# EAGLE design micromouse2019 (EAGLE 9.3.2)
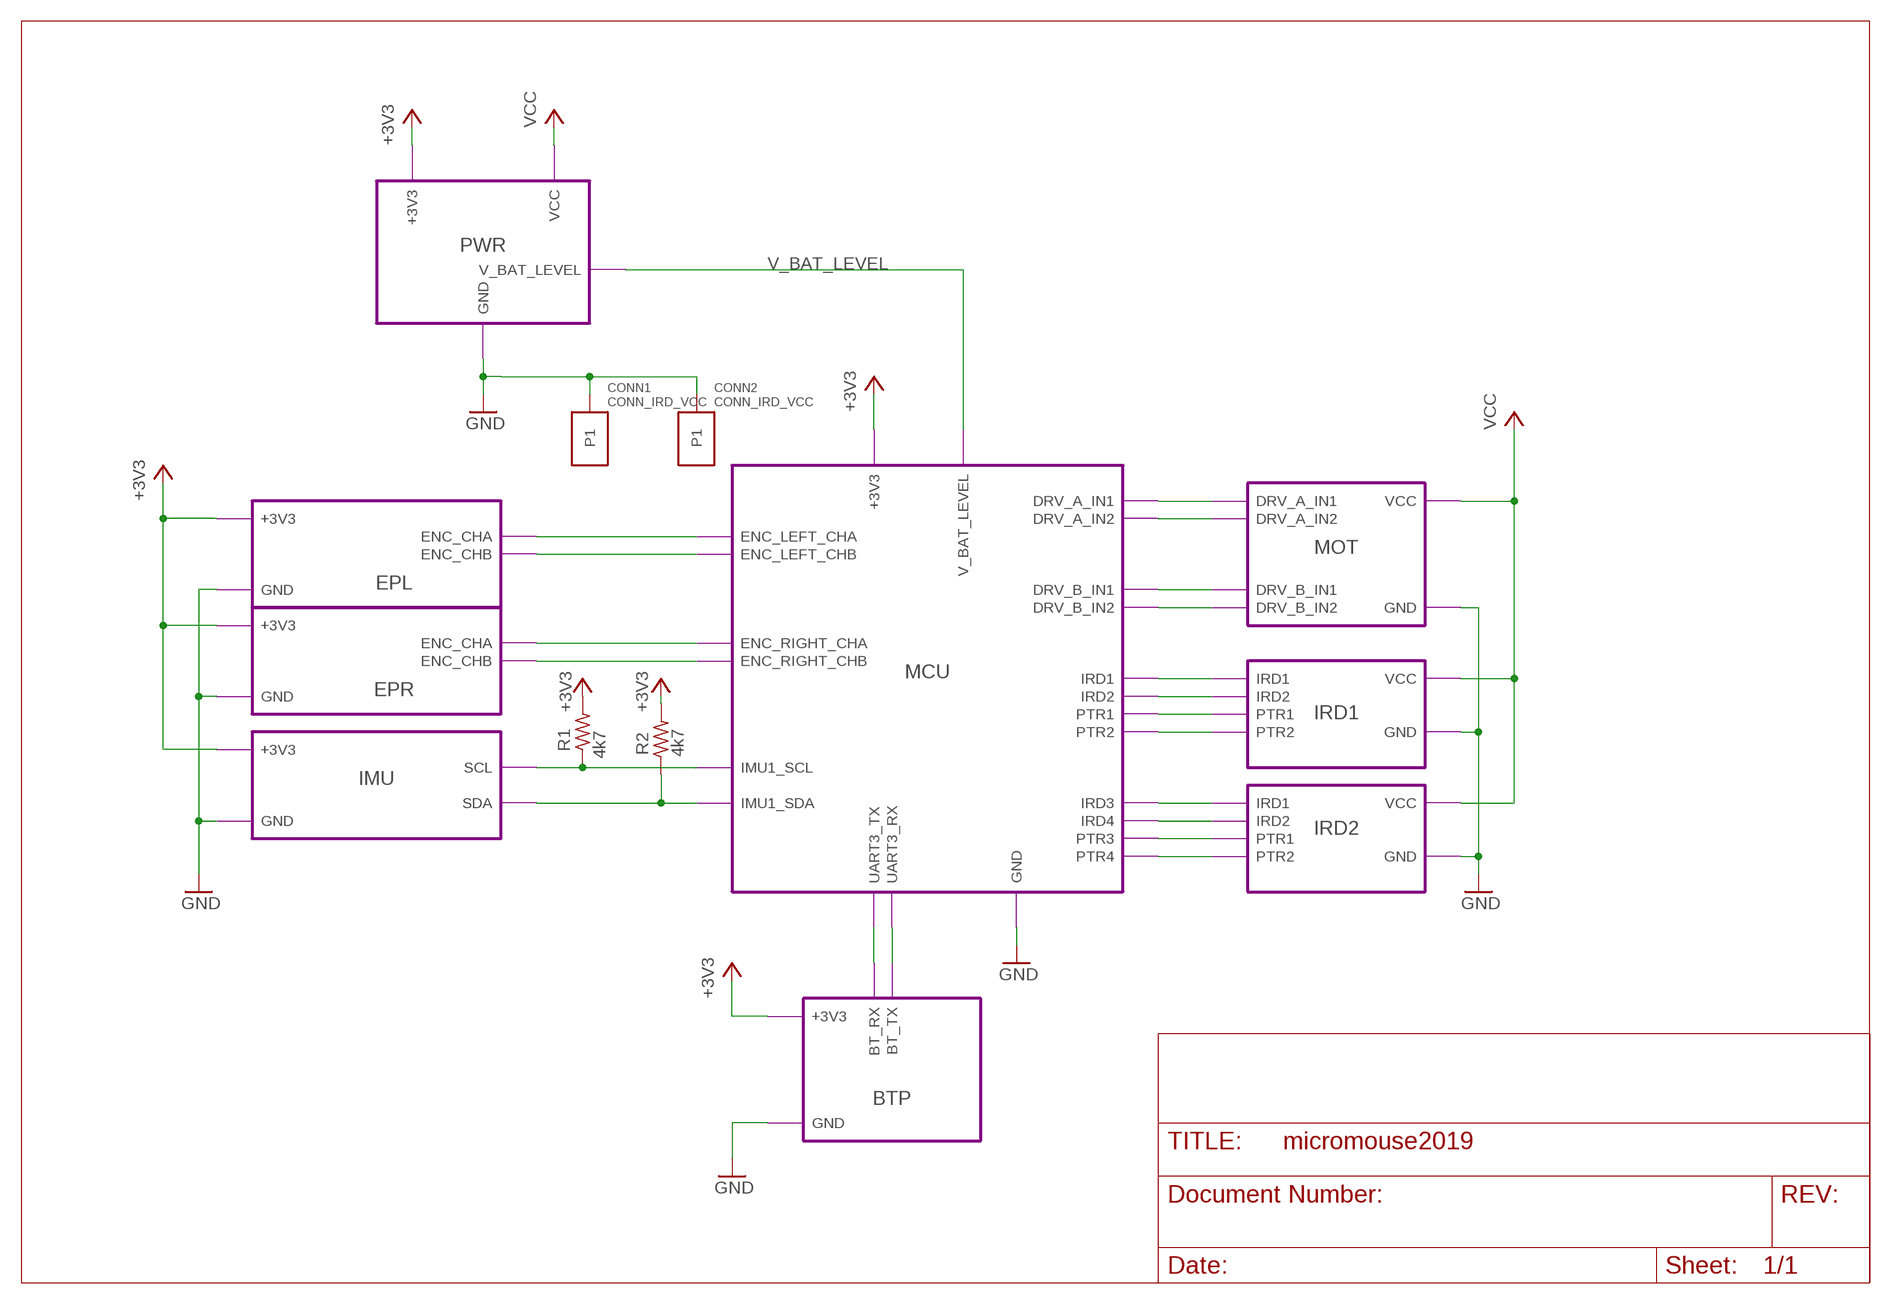
[diagram p0: schematic, sheet 1]

## Parts
CONN1  CONN_IRD_VCC  [CONN_IRD_VCC_HDRV1W64P0_1X1_254X254X838B]
CONN2  CONN_IRD_VCC  [CONN_IRD_VCC_HDRV1W64P0_1X1_254X254X838B]
R1  4k7  R-US_R0402  [R0402]
R2  4k7  R-US_R0402  [R0402]

## Module instances
PWR = POWER_REGULATOR
IMU = INERTIAL_MEASUREMENT_UNIT
MOT = MOTOR_DRIVER
EPR = ENCODER_PORT
BTP = WIRELESS_MODUL_PORT
EPL = ENCODER_PORT
MCU = MICROCONTROLLER
IRD1 = IR_LEDS_AND_PTS
IRD2 = IR_LEDS_AND_PTS

## Nets
+3V3: R1.2 R2.2 ; port PWR.+3V3 MCU.+3V3 IMU.+3V3 EPL.+3V3 EPR.+3V3 BTP.+3V3
DRV_A_IN1: port MOT.DRV_A_IN1 MCU.DRV_A_IN1
DRV_A_IN2: port MOT.DRV_A_IN2 MCU.DRV_A_IN2
DRV_B_IN1: port MOT.DRV_B_IN1 MCU.DRV_B_IN1
DRV_B_IN2: port MOT.DRV_B_IN2 MCU.DRV_B_IN2
ENC_LEFT_CHA: port EPL.ENC_CHA MCU.ENC_LEFT_CHA
ENC_LEFT_CHB: port EPL.ENC_CHB MCU.ENC_LEFT_CHB
ENC_RIGHT_CHA: port EPR.ENC_CHA MCU.ENC_RIGHT_CHA
ENC_RIGHT_CHB: port EPR.ENC_CHB MCU.ENC_RIGHT_CHB
GND: CONN1.1 CONN2.1 ; port PWR.GND IMU.GND EPL.GND EPR.GND MCU.GND MOT.GND IRD1.GND IRD2.GND BTP.GND
N$1: port MCU.IRD1 IRD1.IRD1
N$2: port MCU.IRD2 IRD1.IRD2
N$3: port MCU.PTR1 IRD1.PTR1
N$4: port MCU.PTR2 IRD1.PTR2
N$5: port MCU.IRD3 IRD2.IRD1
N$6: port MCU.IRD4 IRD2.IRD2
N$7: port MCU.PTR3 IRD2.PTR1
N$8: port MCU.PTR4 IRD2.PTR2
SCL: R1.1 ; port IMU.SCL MCU.IMU1_SCL
SDA: R2.1 ; port IMU.SDA MCU.IMU1_SDA
UART3_RX: port MCU.UART3_RX BTP.BT_TX
UART3_TX: port BTP.BT_RX MCU.UART3_TX
V_BAT_LEVEL: port PWR.V_BAT_LEVEL MCU.V_BAT_LEVEL
VCC: port PWR.VCC MOT.VCC IRD1.VCC IRD2.VCC

## Library data of the parts
CONN1 CONN2 = 0-micromouse2019:CONN_IRD_VCC: Pin for connection to +3v3 of IR LEDs and phototransistors
R1 R2 = 0-micromouse2019:R-US_: RESISTOR, American symbol; SPICEPREFIX: R

## Module POWER_REGULATOR
Ports: +3V3(pwr) VCC(pwr) GND(pwr) V_BAT_LEVEL(out)
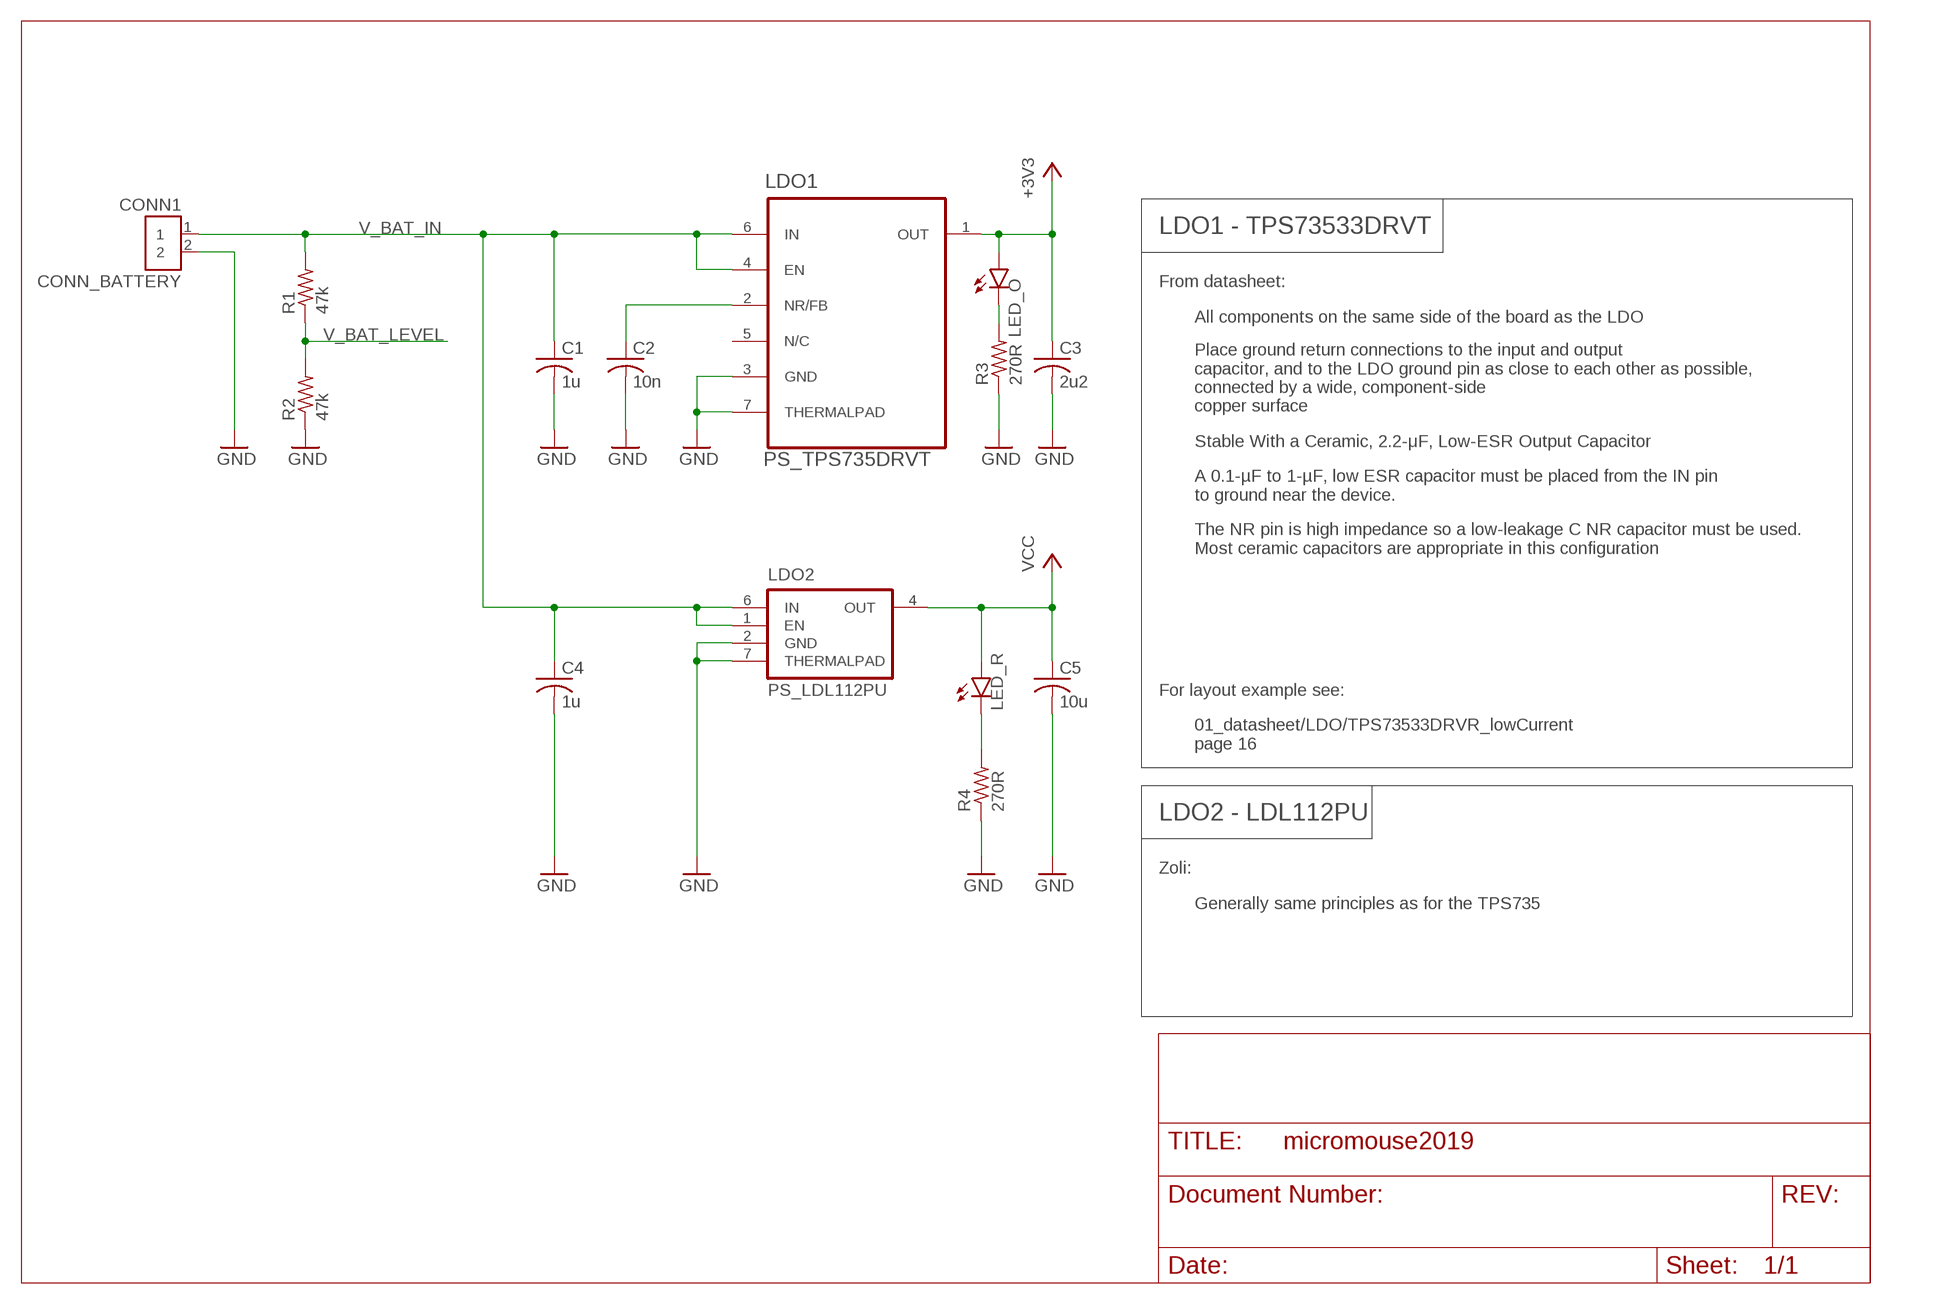
[diagram p1: schematic, module POWER_REGULATOR, sheet 1]

### Parts
C1  1u  C-USC0402  [C0402]
C2  10n  C-USC0402  [C0402]
C3  2u2  C-USC0402  [C0402]
C4  1u  C-USC0402  [C0402]
C5  10u  C-USC0402  [C0402]
CONN1  CONN_BATTERY  [JST_B2B-PH-K-S(LF)(SN)]
LDO1  PS_TPS735DRVT  [SON65P200X200X80-7T100X160]
LDO2  PS_LDL112PU  [SON50P200X200X80-7T92X145]
LED1  LED_O  [0603-ORANGE]
LED2  LED_R  [0603-RED]
R1  47k  R-US_R0402  [R0402]
R2  47k  R-US_R0402  [R0402]
R3  270R  R-US_R0402  [R0402]
R4  270R  R-US_R0402  [R0402]

### Nets
+3V3: C3.1 LDO1.1(OUT) LED1.A
GND: C1.2 C2.2 C3.2 C4.2 C5.2 CONN1.2 LDO1.3(GND) LDO1.7(THERMALPAD) LDO2.2(GND) LDO2.7(THERMALPAD) R2.1 R3.1 R4.1
N$1: C2.1 LDO1.2(NR/FB)
N$2: LED1.C R3.2
N$4: LED2.C R4.2
V_BAT_IN: C1.1 C4.1 CONN1.1 LDO1.4(EN) LDO1.6(IN) LDO2.1(EN) LDO2.6(IN) R1.2
V_BAT_LEVEL: R1.1 R2.2
VCC: C5.1 LDO2.4(OUT) LED2.A
Unconnected: LDO1.5(N/C)

### Notes on the sheet
- LDO1 - TPS73533DRVT
- From datasheet:
- All components on the same side of the board as the LDO
- Place ground return connections to the input and output
  capacitor, and to the LDO ground pin as close to each other as possible,
  connected by a wide, component-side
  copper surface
- Stable With a Ceramic, 2.2-μF, Low-ESR Output Capacitor
- A 0.1-µF to 1-µF, low ESR capacitor must be placed from the IN pin
  to ground near the device.
- The NR pin is high impedance so a low-leakage C NR capacitor must be used.
  Most ceramic capacitors are appropriate in this configuration
- For layout example see:
- 01_datasheet/LDO/TPS73533DRVR_lowCurrent
  page 16
- LDO2 - LDL112PU
- Zoli:
- Generally same principles as for the TPS735

### Library data of the parts
C1-C5 = 0-micromouse2019:C-US: CAPACITOR, American symbol; SPICEPREFIX: C
CONN1 = 0-micromouse2019:CONN_BATTERY: PH Series 2 Position 2 mm Pitch Through Hole Top Entry Shrouded Header; AVAILABILITY: Unavailable; DESCRIPTION: PH Series 2 Position 2 mm Pitch Through Hole Top Entry Shrouded Header; MF: JST Sales; MP: B2B-PH-K-S(LF)(SN); PACKAGE: None; PRICE: None
LDO1 = 0-micromouse2019:PS_TPS735: 500mA, Low Quiescent Current, Ultra-Low Noise, High PSRR Low Dropout Linear Regulator
LDO2 = 0-micromouse2019:PS_LDL112: Low-dropout linear regulator from ST. The LDL112 is a low-dropout linear regulator, which can provide a maximum current of 1.2 A, with a typical dropout voltage of 300 mV.
LED1 LED2 = 0-micromouse2019:LED: Indicator LEDs; SERIES_RESISTOR: 270R
R1-R4 = 0-micromouse2019:R-US_: RESISTOR, American symbol; SPICEPREFIX: R

## Module INERTIAL_MEASUREMENT_UNIT
Ports: SDA(io) SCL(io) +3V3(pwr) GND(pwr)
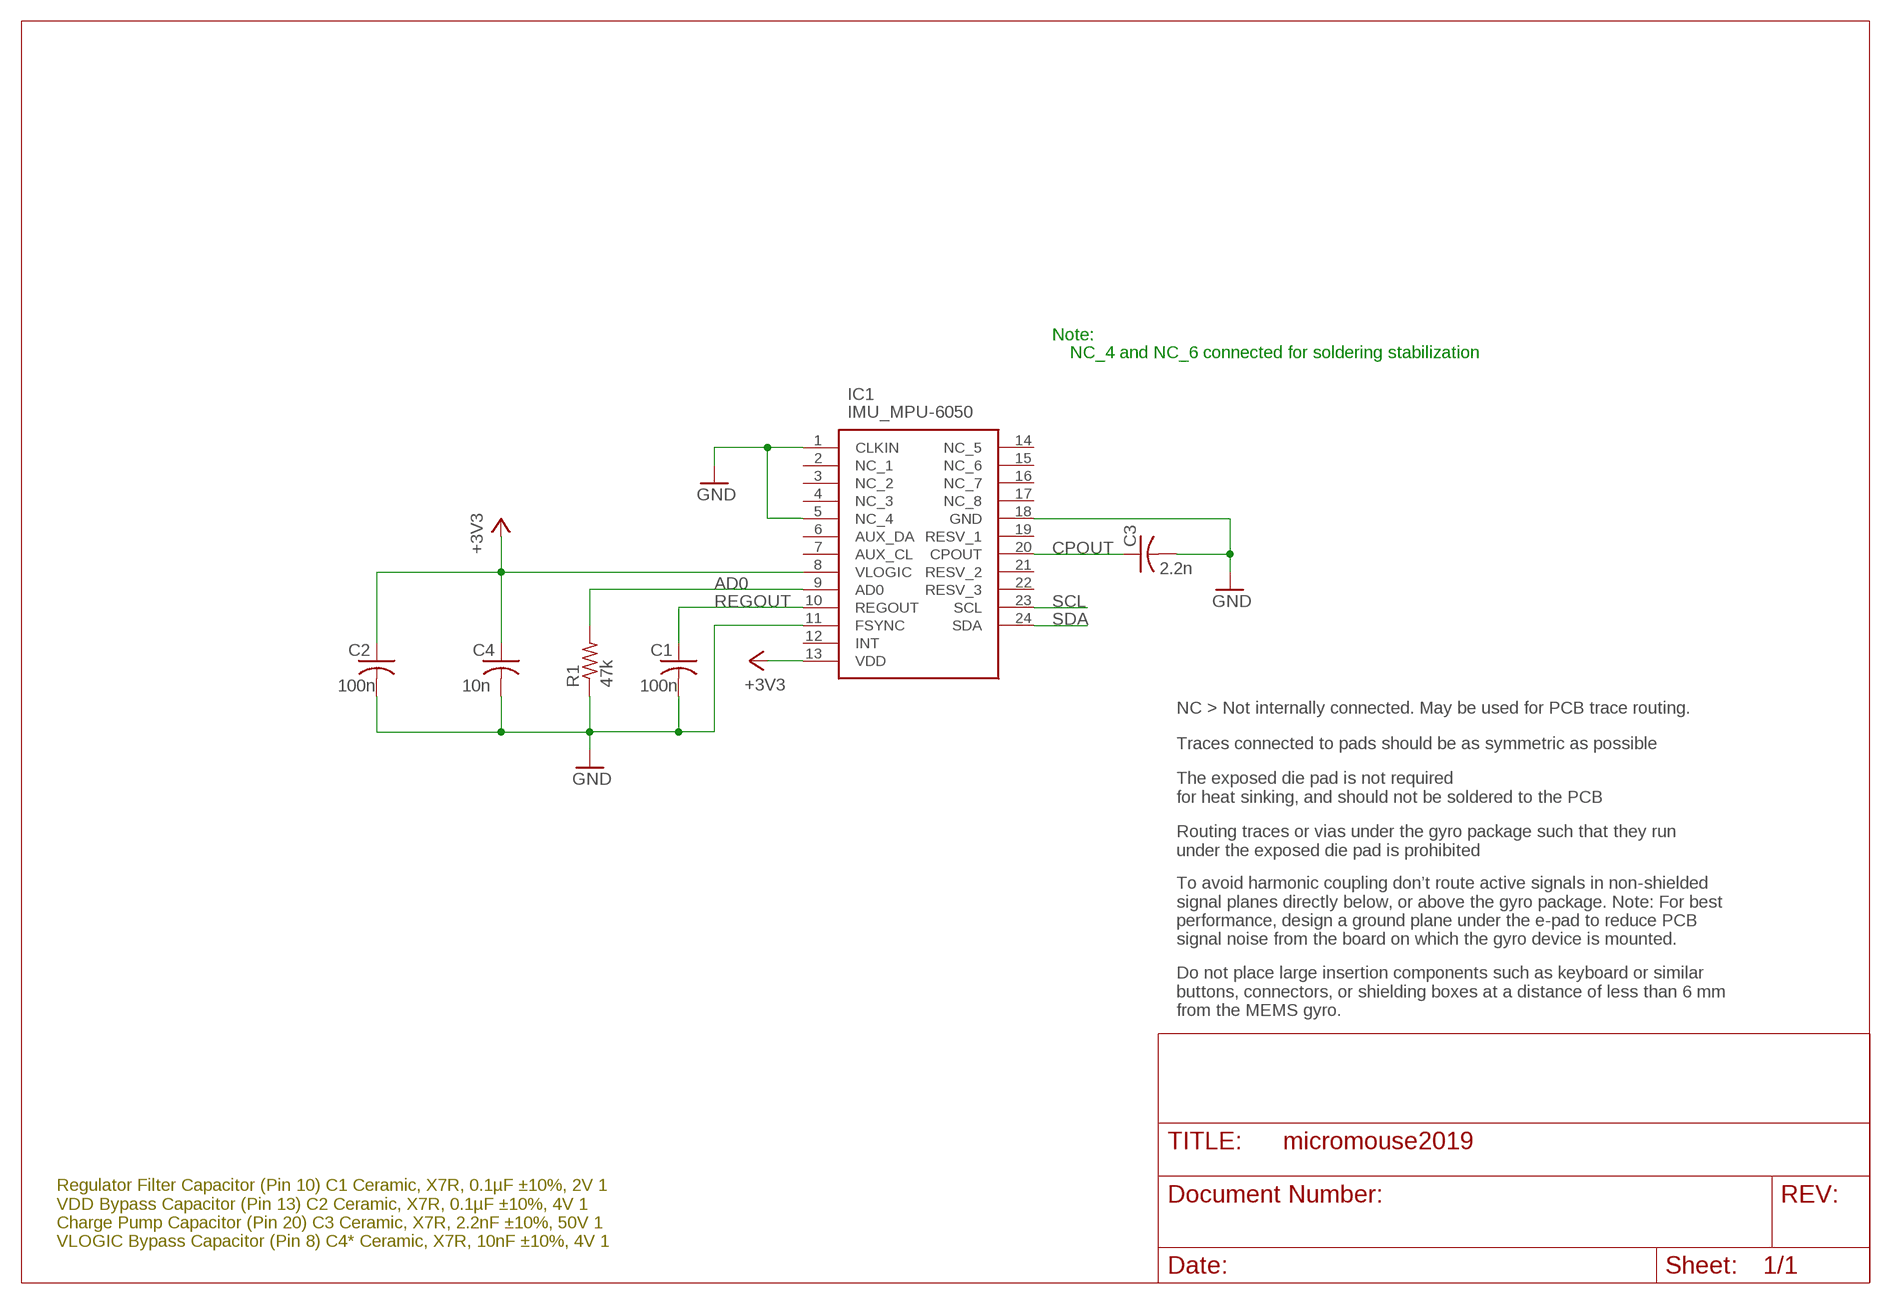
[diagram p2: schematic, module INERTIAL_MEASUREMENT_UNIT, sheet 1]

### Parts
C1  100n  C-USC0402  [C0402]
C2  100n  C-USC0402  [C0402]
C3  2.2n  C-USC0402  [C0402]
C4  10n  C-USC0402  [C0402]
IC1  IMU_MPU-6050  [MPU6050]
R1  47k  R-US_R0402  [R0402]

### Nets
+3V3: C2.1 C4.1 IC1.8(VLOGIC) IC1.13(VDD)
AD0: IC1.9(AD0) R1.2
CPOUT: C3.1 IC1.20(CPOUT)
GND: C1.2 C2.2 C3.2 C4.2 IC1.1(CLKIN) IC1.5(NC_4) IC1.11(FSYNC) IC1.18(GND) R1.1
REGOUT: C1.1 IC1.10(REGOUT)
SCL: IC1.23(SCL)
SDA: IC1.24(SDA)
Unconnected: IC1.2(NC_1) IC1.3(NC_2) IC1.4(NC_3) IC1.6(AUX_DA) IC1.7(AUX_CL) IC1.12(INT) IC1.14(NC_5) IC1.15(NC_6) IC1.16(NC_7) IC1.17(NC_8) IC1.19(RESV_1) IC1.21(RESV_2) IC1.22(RESV_3)

### Notes on the sheet
- Note:
- NC_4 and NC_6 connected for soldering stabilization
- NC > Not internally connected. May be used for PCB trace routing.
- Traces connected to pads should be as symmetric as possible
- The exposed die pad is not required
  for heat sinking, and should not be soldered to the PCB
- Routing traces or vias under the gyro package such that they run
  under the exposed die pad is prohibited
- To avoid harmonic coupling don’t route active signals in non-shielded
  signal planes directly below, or above the gyro package. Note: For best
  performance, design a ground plane under the e-pad to reduce PCB
  signal noise from the board on which the gyro device is mounted.
- Do not place large insertion components such as keyboard or similar
  buttons, connectors, or shielding boxes at a distance of less than 6 mm
  from the MEMS gyro.
- Regulator Filter Capacitor (Pin 10) C1 Ceramic, X7R, 0.1µF ±10%, 2V 1
  VDD Bypass Capacitor (Pin 13) C2 Ceramic, X7R, 0.1µF ±10%, 4V 1
  Charge Pump Capacitor (Pin 20) C3 Ceramic, X7R, 2.2nF ±10%, 50V 1
  VLOGIC Bypass Capacitor (Pin 8) C4* Ceramic, X7R, 10nF ±10%, 4V 1

### Library data of the parts
C1-C4 = 0-micromouse2019:C-US: CAPACITOR, American symbol; SPICEPREFIX: C
IC1 = 0-micromouse2019:IMU_MPU-6050: IMUs - Inertial Measurement Units 6-Axis MEMS MotionTracking Device with DMP Source: Datasheet <https://www.mouser.mx/datasheet/2/400/MPU-6000-Datasheet1-1112286.pdf>; DESCRIPTION: IMUs - Inertial Measurement Units 6-Axis MEMS MotionTracking Device with DMP; HEIGHT: 3mm; MANUFACTURER_NAME: TDK; MANUFACTURER_PART_NUMBER: MPU-6050; MOUSER_PART_NUMBER: 410-MPU-6050
R1 = 0-micromouse2019:R-US_: RESISTOR, American symbol; SPICEPREFIX: R

## Module MOTOR_DRIVER
Ports: VCC(pwr) GND(pwr) DRV_A_IN1(in) DRV_A_IN2(in) DRV_B_IN1(in) DRV_B_IN2(in)
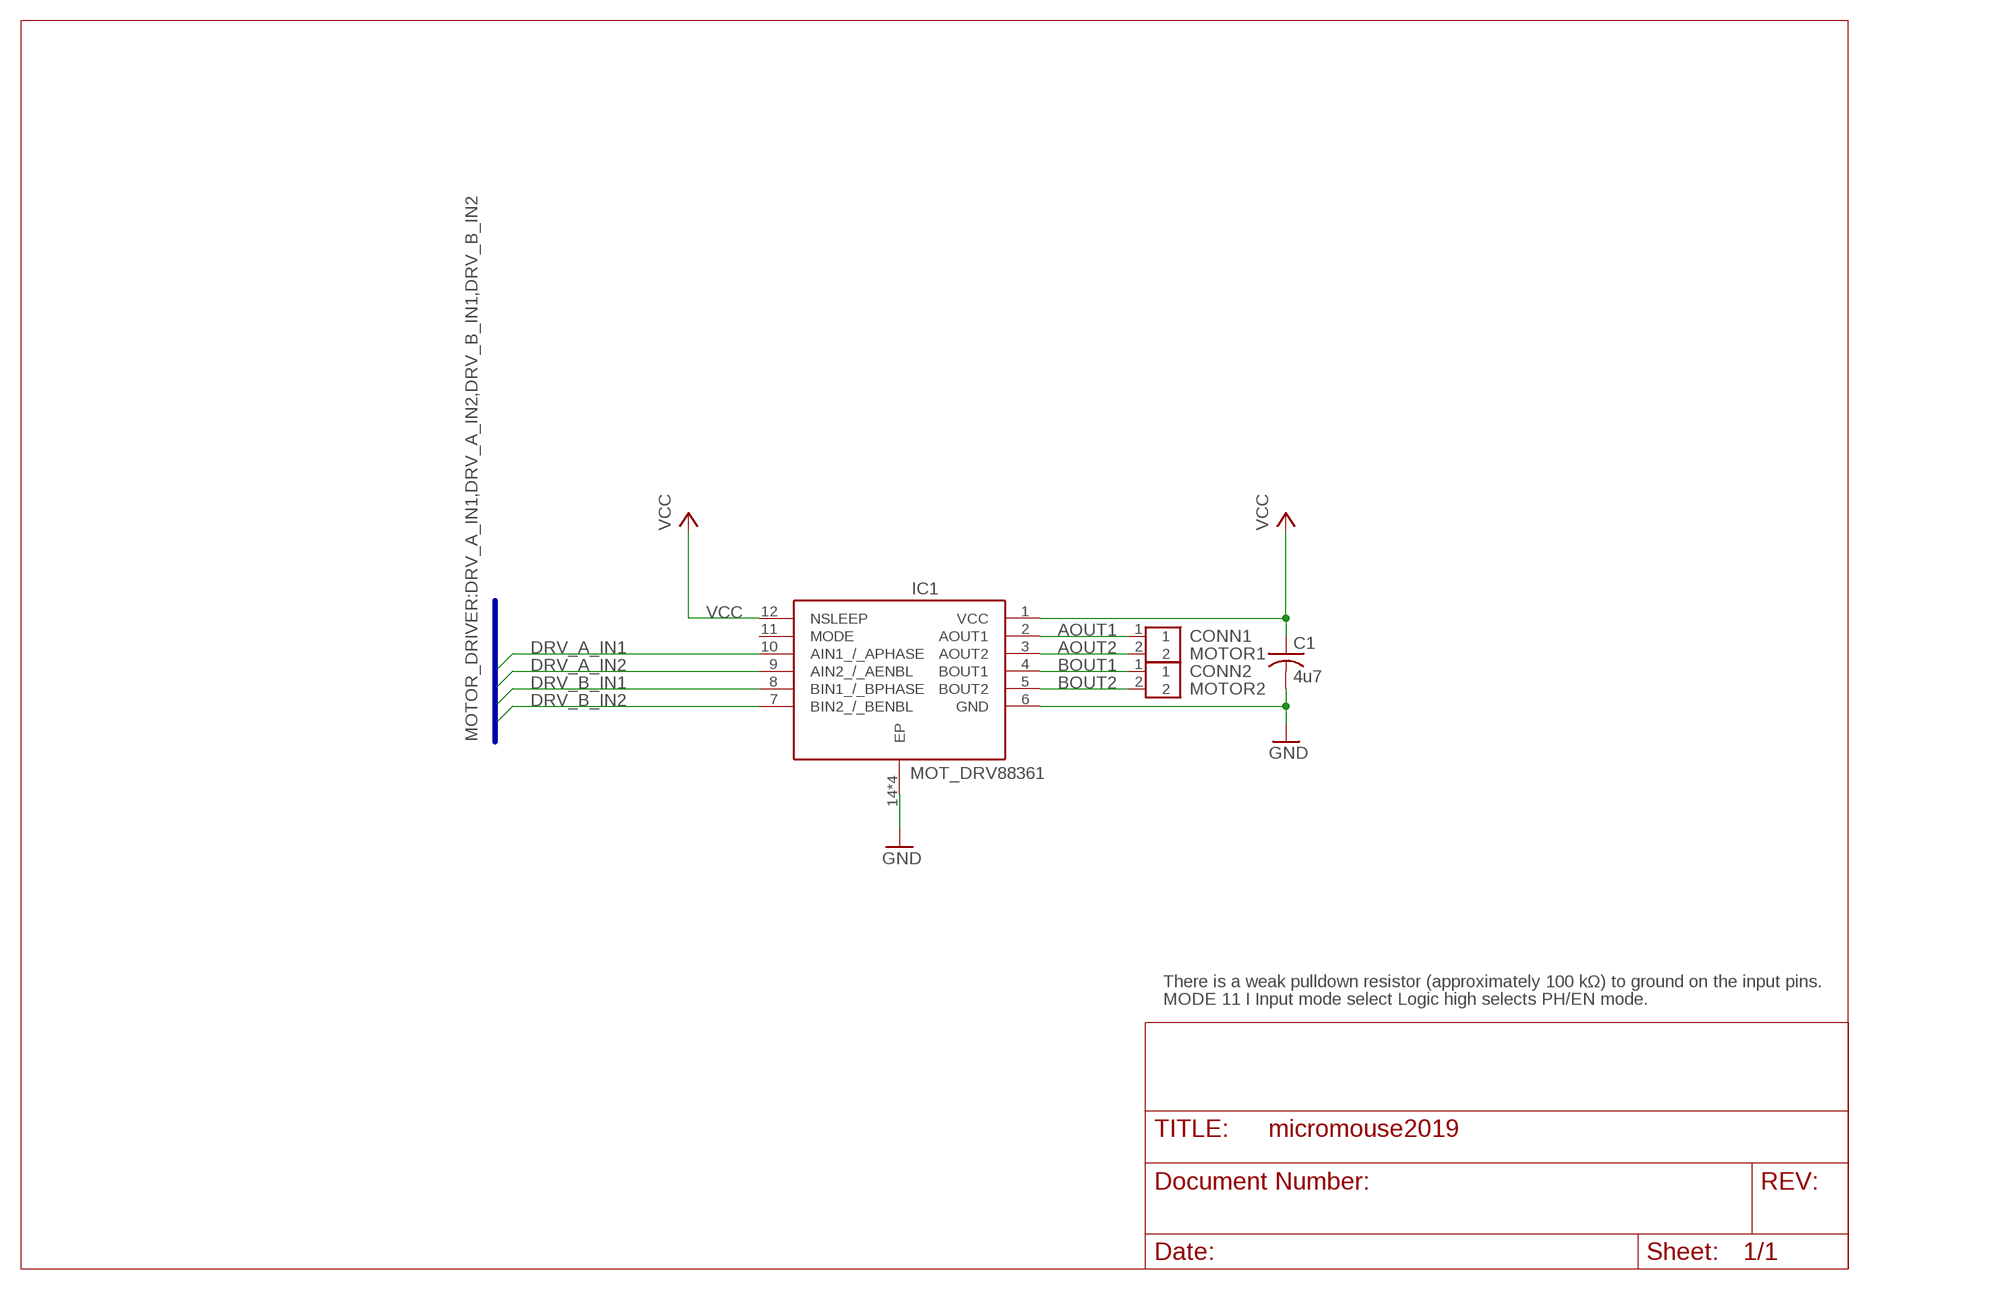
[diagram p3: schematic, module MOTOR_DRIVER, sheet 1]

### Parts
C1  4u7  C-USC0402  [C0402]
CONN1  MOTOR1  CONN_MOTOR  [BM02B-SRSS-TB(LFSN)]
CONN2  MOTOR2  CONN_MOTOR  [BM02B-SRSS-TB(LFSN)]
IC1  MOT_DRV88361  [DRV8836]

### Nets
AOUT1: CONN1.1 IC1.2(AOUT1)
AOUT2: CONN1.2 IC1.3(AOUT2)
BOUT1: CONN2.1 IC1.4(BOUT1)
BOUT2: CONN2.2 IC1.5(BOUT2)
DRV_A_IN1: IC1.10(AIN1_/_APHASE)
DRV_A_IN2: IC1.9(AIN2_/_AENBL)
DRV_B_IN1: IC1.8(BIN1_/_BPHASE)
DRV_B_IN2: IC1.7(BIN2_/_BENBL)
GND: C1.2 IC1.6(GND) IC1.14(EP) IC1.15(EP) IC1.16(EP) IC1.17(EP)
VCC: C1.1 IC1.1(VCC) IC1.12(NSLEEP)
Unconnected: IC1.11(MODE)

### Buses
MOTOR_DRIVER:DRV_A_IN1,DRV_A_IN2,DRV_B_IN1,DRV_B_IN2

### Notes on the sheet
- There is a weak pulldown resistor (approximately 100 kΩ) to ground on the input pins.
- MODE 11 I Input mode select Logic high selects PH/EN mode.

### Library data of the parts
C1 = 0-micromouse2019:C-US: CAPACITOR, American symbol; SPICEPREFIX: C
CONN1 CONN2 = 0-micromouse2019:CONN_MOTOR: 2 way top entry SMT header,1mm pitch JST SH Series, 1mm Pitch 2 Way 1 Row Straight PCB Header, Solder Termination, 1A Source: Datasheet <http://uk.rs-online.com/web/p/products/5151529P>; ALLIED_NUMBER: R1044255; DESCRIPTION: 2 way top entry SMT header,1mm pitch JST SH Series, 1mm Pitch 2 Way 1 Row Straight PCB Header, Solder Termination, 1A; HEIGHT: mm; MANUFACTURER_NAME: JST (JAPAN SOLDERLESS TERMINALS); MANUFACTURER_PART_NUMBER: BM02B-SRSS-TB(LFSN); RS_PART_NUMBER: 5151529P; RS_PRICE-STOCK: https://www.alliedelec.com/jst-manufacturing-bm02b-srss-tb-lfsn-/R1044255/
IC1 = 0-micromouse2019:MOT_DRV8836: 1.5A Low Voltage Stepper or Single/Dual Brushed DC Motor Driver (PWM or PH/EN Ctrl) Source: Datasheet <http://www.ti.com/lit/gpn/drv8836>; DESCRIPTION: 1.5A Low Voltage Stepper or Single/Dual Brushed DC Motor Driver (PWM or PH/EN Ctrl); HEIGHT: 0.8mm; MANUFACTURER_NAME: Texas Instruments; MANUFACTURER_PART_NUMBER: DRV8836DSSR; MOUSER_PART_NUMBER: 595-DRV8836DSSR

## Module ENCODER_PORT
Ports: ENC_CHA(out) ENC_CHB(out) +3V3(pwr) GND(pwr)
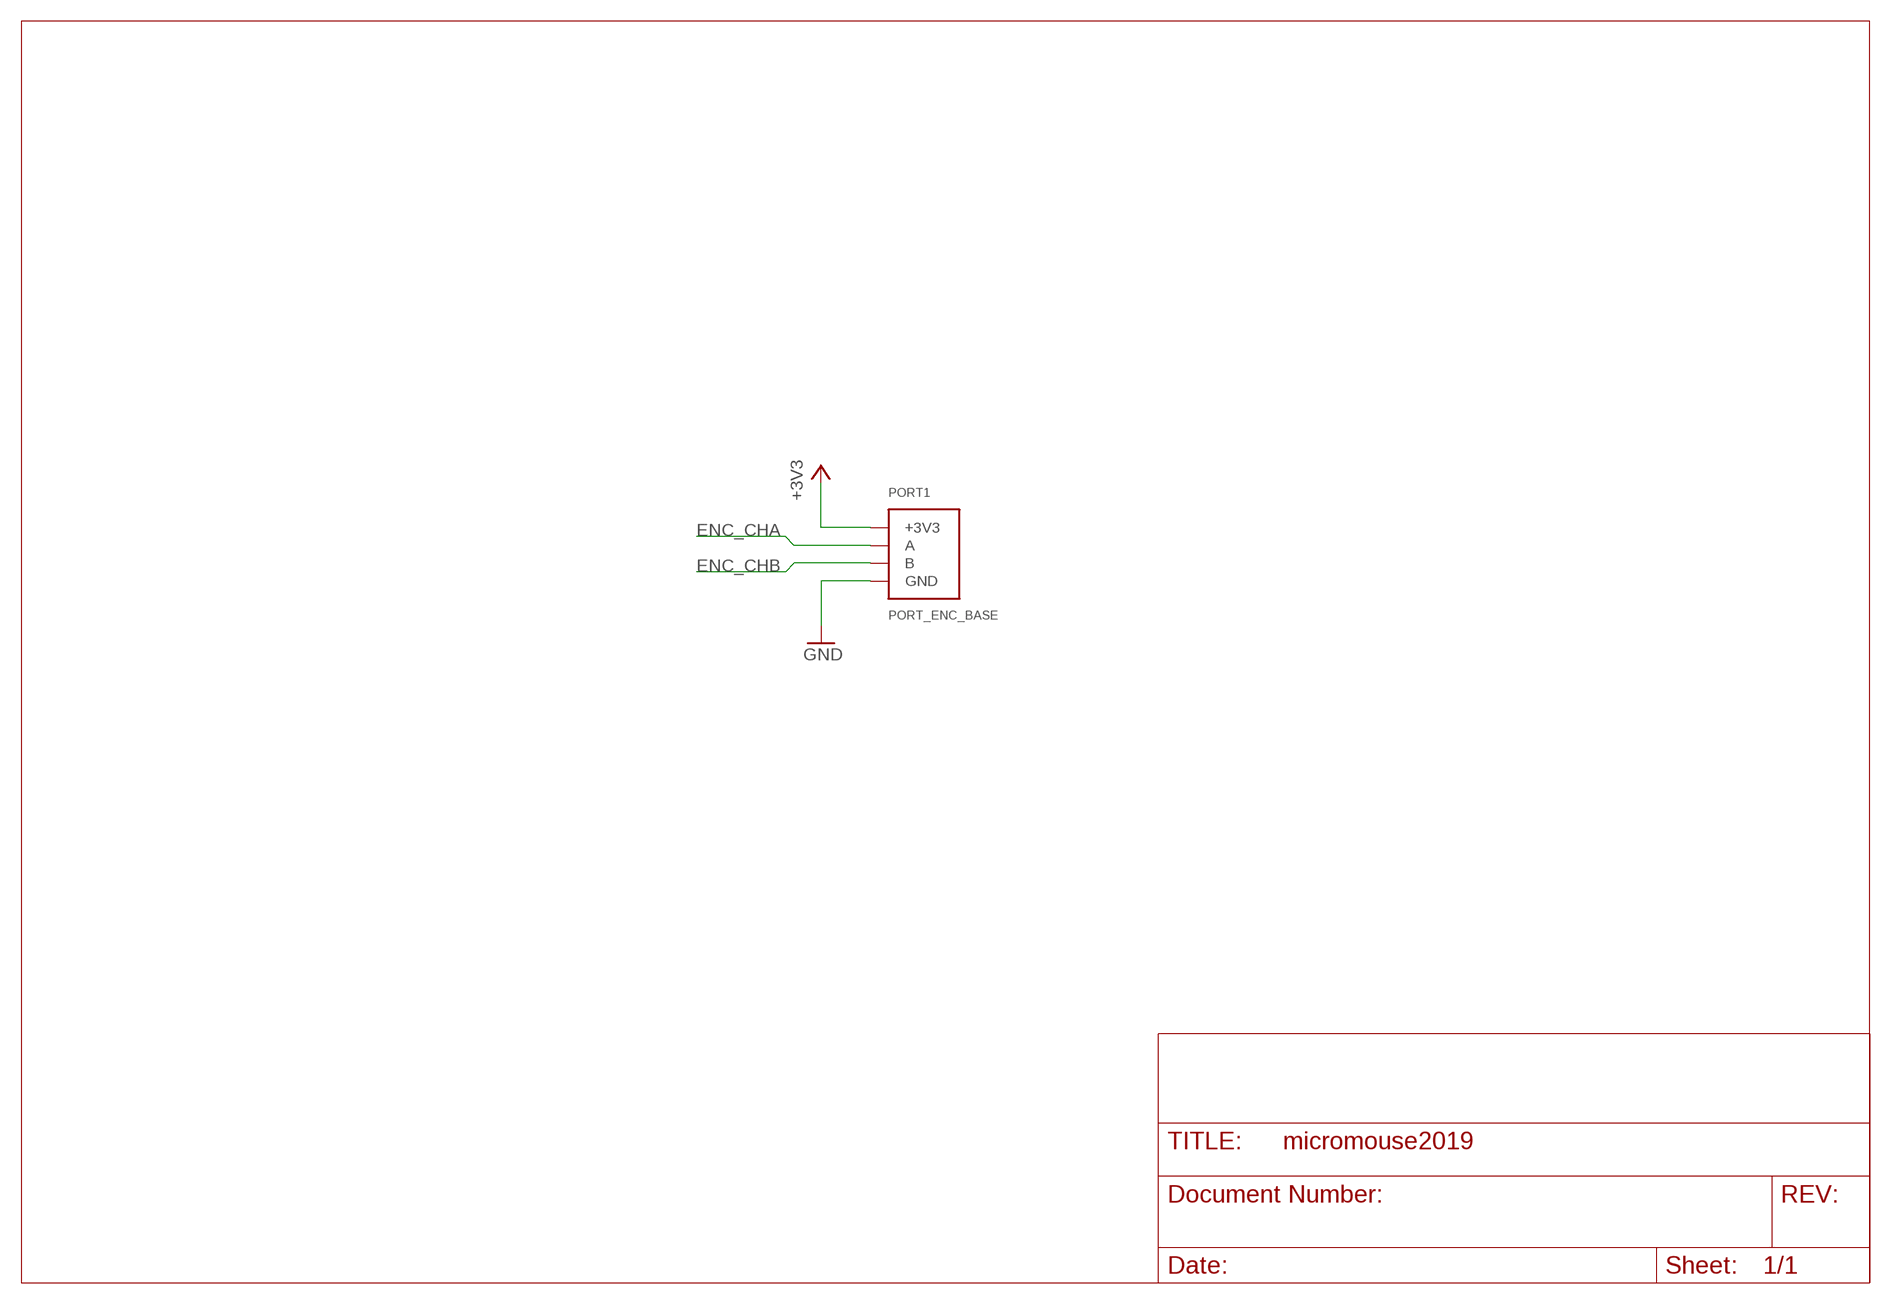
[diagram p4: schematic, module ENCODER_PORT, sheet 1]

### Parts
PORT1  PORT_ENC_BASE  [ENC_PORT_BASE]

### Nets
+3V3: PORT1.P3(+3V3)
ENC_CHA: PORT1.P1(A)
ENC_CHB: PORT1.P2(B)
GND: PORT1.P4(GND)

### Library data of the parts
PORT1 = 0-micromouse2019:PORT_ENC: Connection pins between ENC_PCB and MOUSE_PCB

## Module WIRELESS_MODUL_PORT
Ports: BT_TX(out) BT_RX(in) +3V3(pwr) GND(pwr)
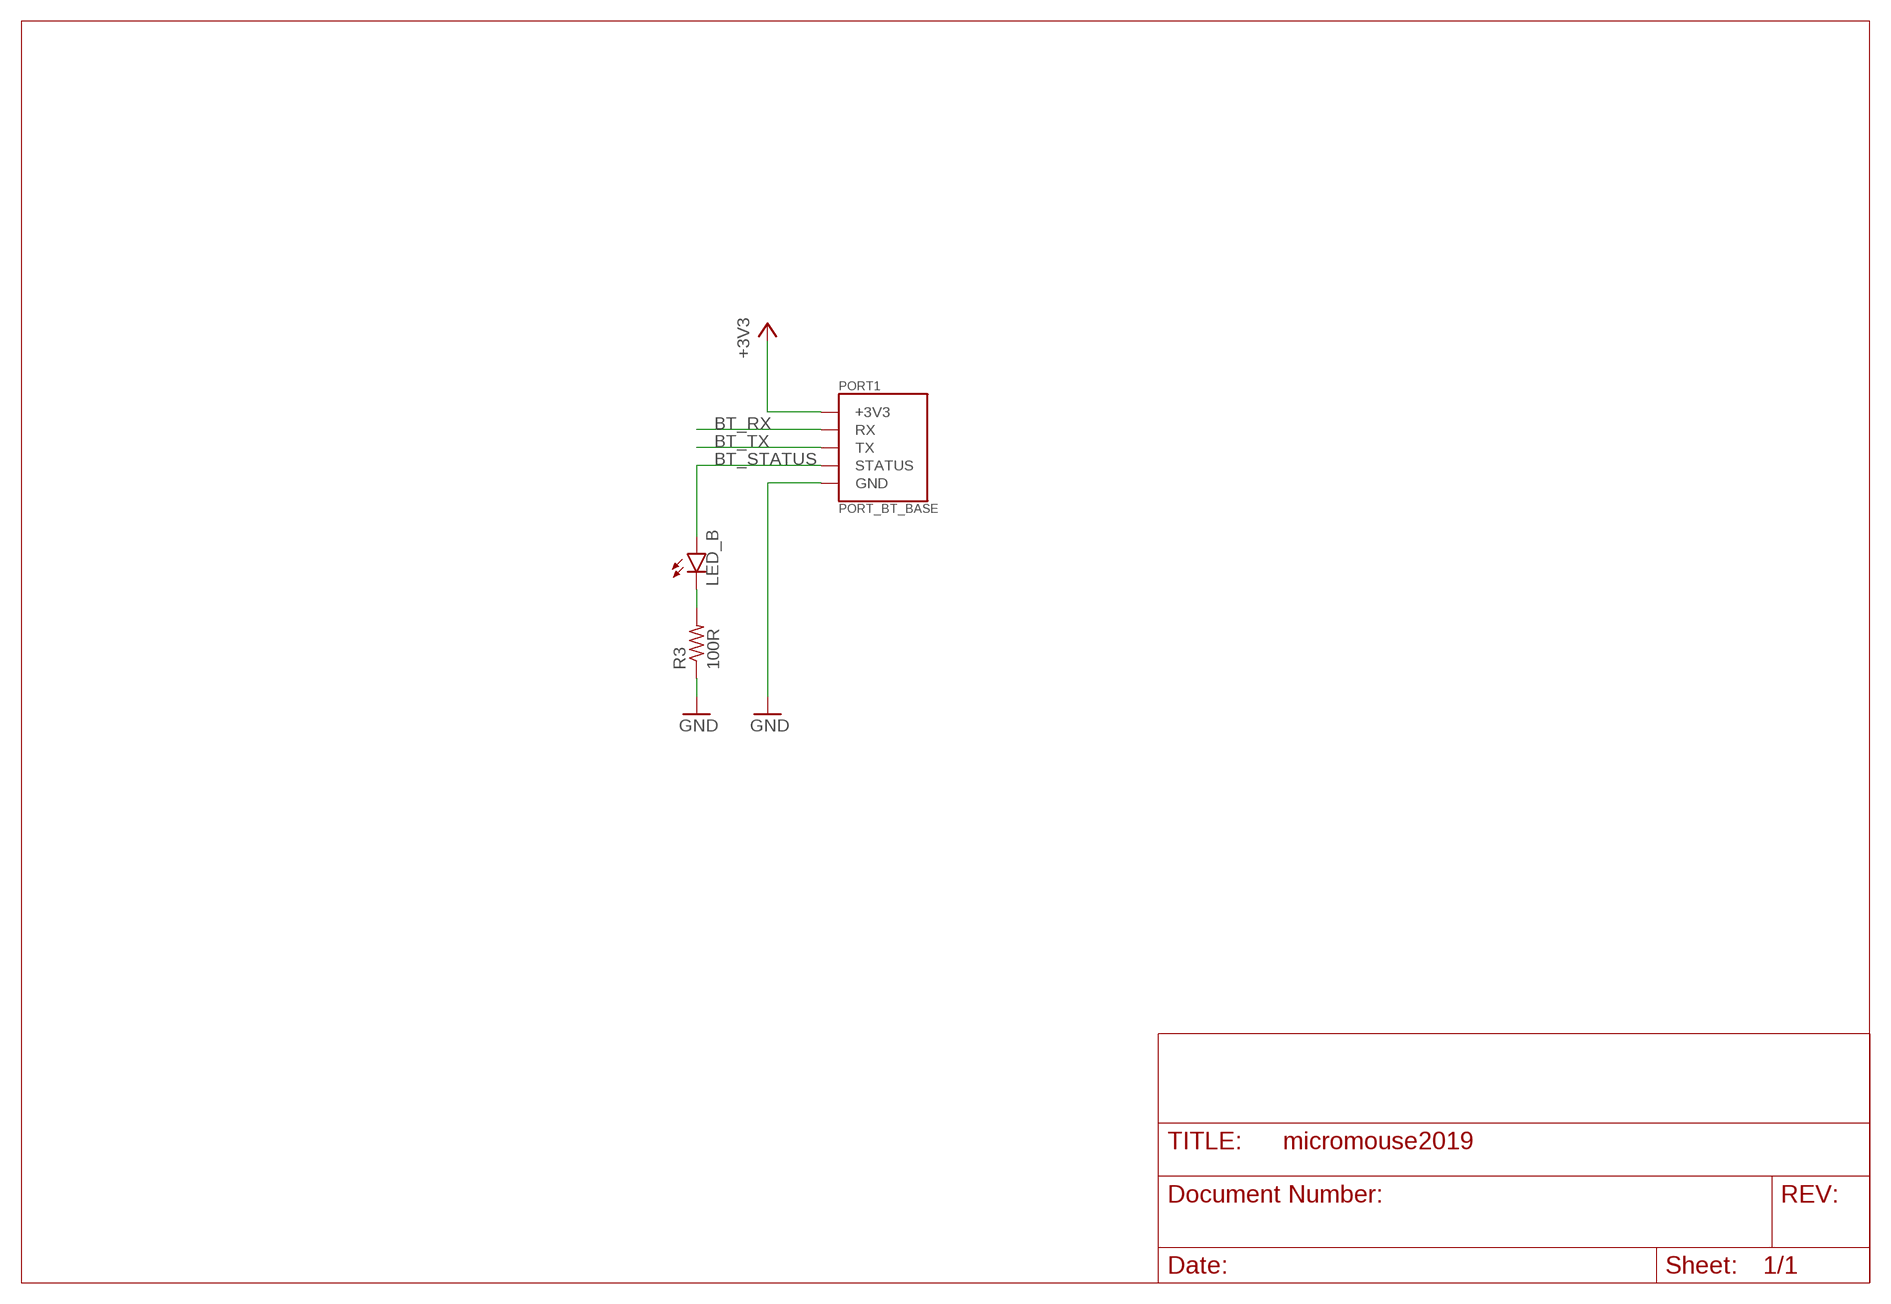
[diagram p5: schematic, module WIRELESS_MODUL_PORT, sheet 1]

### Parts
LED3  LED_B  [0603-BLUE]
PORT1  PORT_BT_BASE  [BT_PORT_BASE]
R3  100R  R-US_R0402  [R0402]

### Nets
+3V3: PORT1.P$15(+3V3)
BT_RX: PORT1.P$9(RX)
BT_STATUS: LED3.A PORT1.P$11(STATUS)
BT_TX: PORT1.P$8(TX)
GND: PORT1.P$14(GND) R3.1
N$3: LED3.C R3.2

### Library data of the parts
LED3 = 0-micromouse2019:LED: Indicator LEDs; SERIES_RESISTOR: 100R
PORT1 = 0-micromouse2019:PORT_BT: Port between mouse pcb and bluetooth module
R3 = 0-micromouse2019:R-US_: RESISTOR, American symbol; SPICEPREFIX: R

## Module MICROCONTROLLER
Ports: +3V3(pwr) V_BAT_LEVEL(pwr) UART3_TX(out) UART3_RX(in) ENC_LEFT_CHA(in) ENC_LEFT_CHB(in) ENC_RIGHT_CHA(in) ENC_RIGHT_CHB(in) IMU1_SCL(io) IMU1_SDA(io) GND(pwr) IRD1(out) IRD2(out) IRD3(out) IRD4(out) PTR1(in) PTR2(in) PTR3(in) PTR4(in) DRV_A_IN1(out) DRV_A_IN2(out) DRV_B_IN1(out) DRV_B_IN2(out)
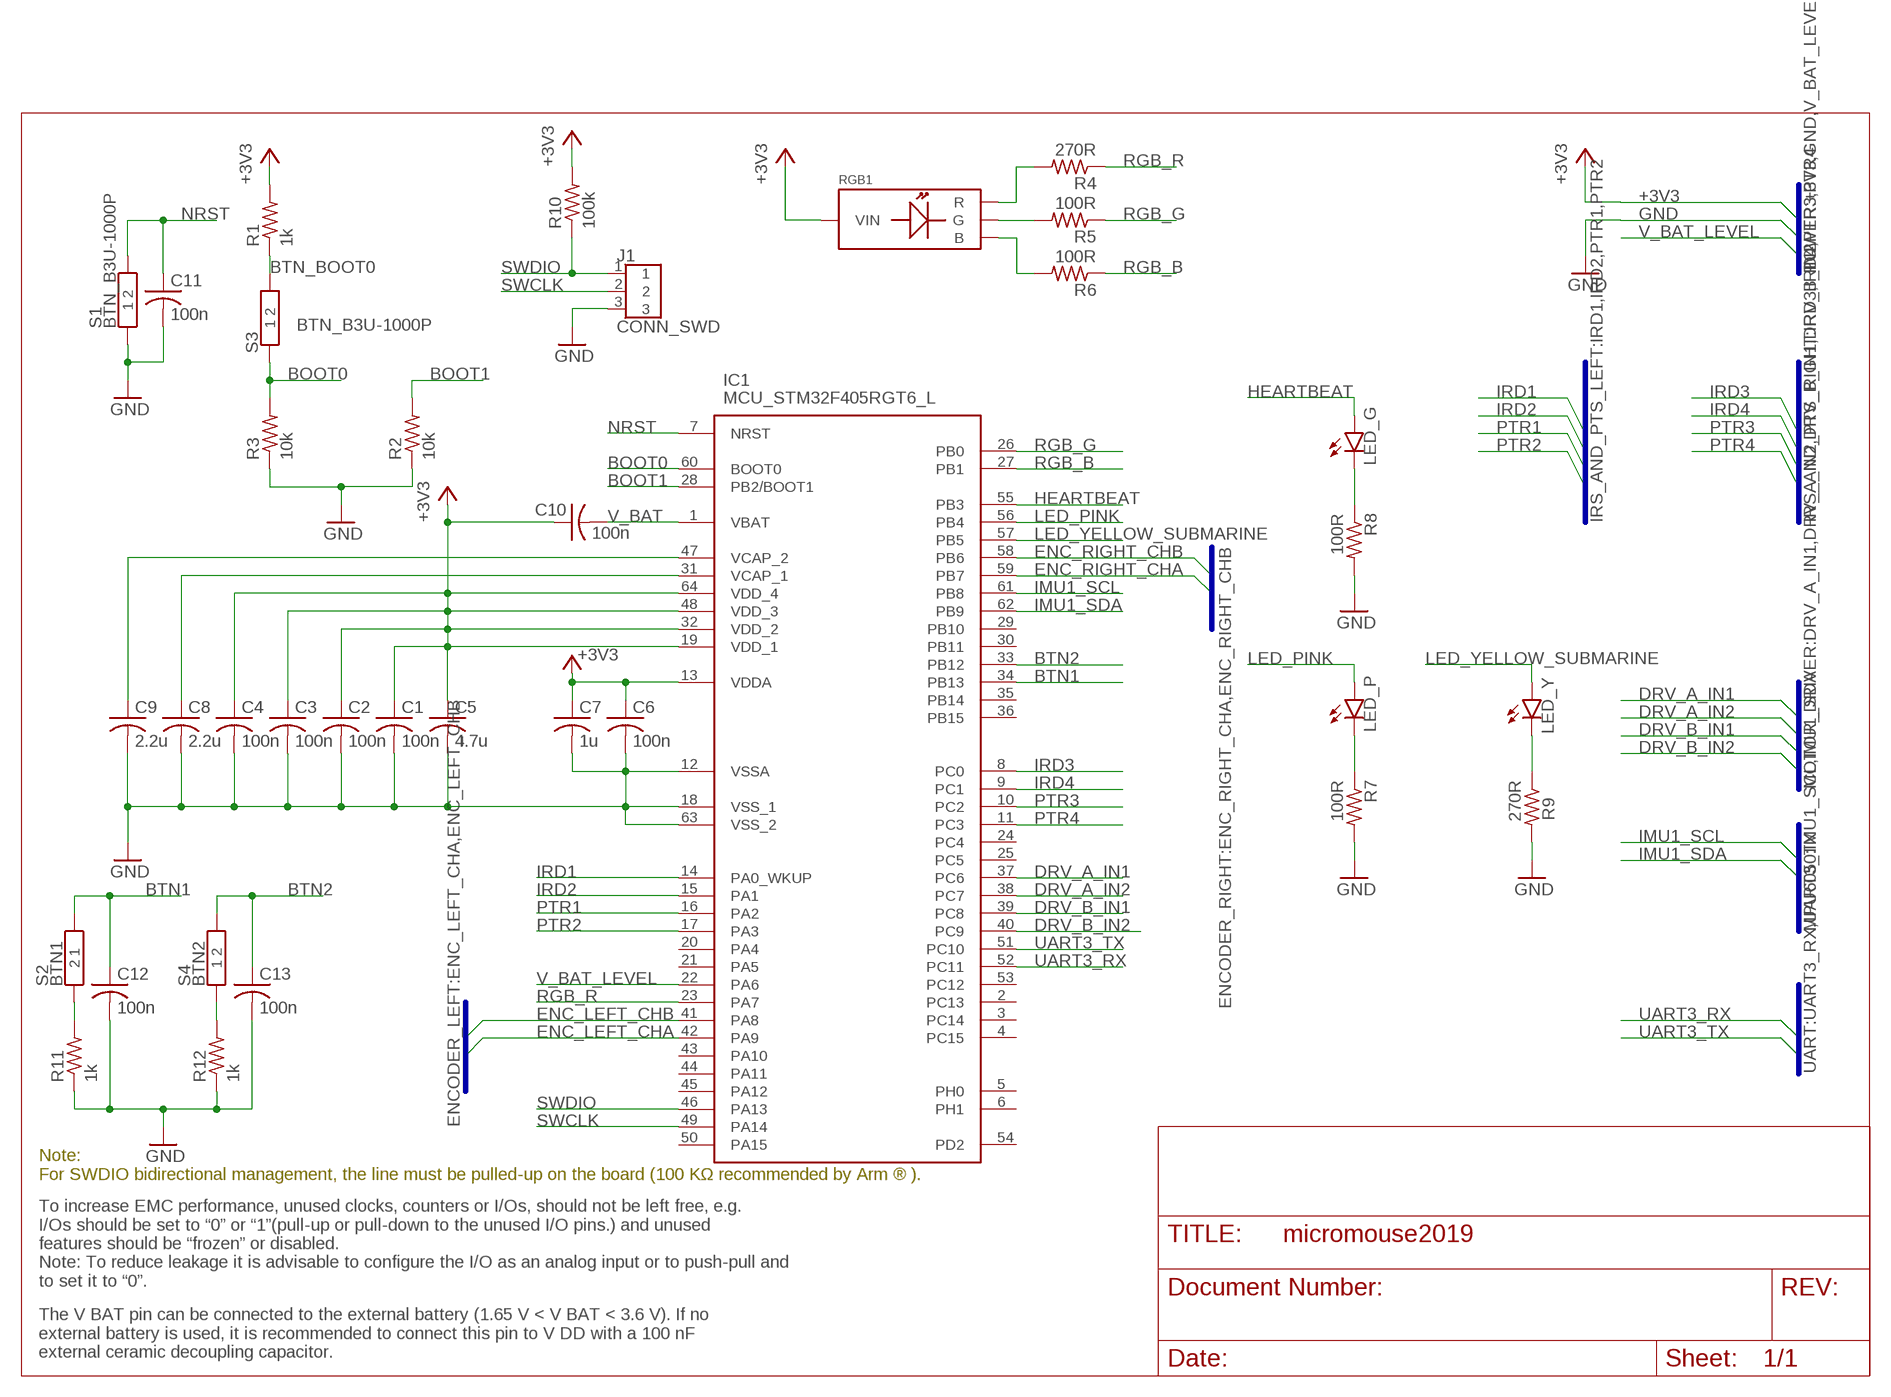
[diagram p6: schematic, module MICROCONTROLLER, sheet 1]

### Parts
C1  100n  C-USC0402  [C0402]
C2  100n  C-USC0402  [C0402]
C3  100n  C-USC0402  [C0402]
C4  100n  C-USC0402  [C0402]
C5  4.7u  C-USC0402  [C0402]
C6  100n  C-USC0402  [C0402]
C7  1u  C-USC0402  [C0402]
C8  2.2u  C-USC0402  [C0402]
C9  2.2u  C-USC0402  [C0402]
C10  100n  C-USC0402  [C0402]
C11  100n  C-USC0402  [C0402]
C12  100n  C-USC0402  [C0402]
C13  100n  C-USC0402  [C0402]
IC1  MCU_STM32F405RGT6_L  [QFP50P1200X1200X160-64N]
J1  CONN_SWD  CONN_PROG  [SM03B-SRSS-TB(LFSN)]
LED1  LED_P  [0603-PINK]
LED2  LED_G  [0603-GREEN]
LED3  LED_Y  [0603-YELLOW]
R1  1k  R-US_R0402  [R0402]
R2  10k  R-US_R0402  [R0402]
R3  10k  R-US_R0402  [R0402]
R4  270R  R-US_R0402  [R0402]
R5  100R  R-US_R0402  [R0402]
R6  100R  R-US_R0402  [R0402]
R7  100R  R-US_R0402  [R0402]
R8  100R  R-US_R0402  [R0402]
R9  270R  R-US_R0402  [R0402]
R10  100k  R-US_R0402  [R0402]
R11  1k  R-US_R0402  [R0402]
R12  1k  R-US_R0402  [R0402]
RGB1  LED_RGB-0603  [D_RGB_0603]
S1  BTN_B3U-1000P  [B3U-1000P]
S2  BTN1  BTN_B3U-3000P  [B3U-3000P]
S3  BTN_B3U-1000P  [B3U-1000P]
S4  BTN2  BTN_B3U-3000P  [B3U-3000P]

### Nets
+3V3: C1.1 C2.1 C3.1 C4.1 C5.1 C6.1 C7.1 C10.1 IC1.13(VDDA) IC1.19(VDD_1) IC1.32(VDD_2) IC1.48(VDD_3) IC1.64(VDD_4) R1.2 R10.2 RGB1.P$1(VIN)
BOOT0: IC1.60(BOOT0) R3.2 S3.1
BOOT1: IC1.28(PB2/BOOT1) R2.2
BTN1: C12.1 IC1.34(PB13) S2.1
BTN2: C13.1 IC1.33(PB12) S4.2
BTN_BOOT0: R1.1 S3.2
DRV_A_IN1: IC1.37(PC6)
DRV_A_IN2: IC1.38(PC7)
DRV_B_IN1: IC1.39(PC8)
DRV_B_IN2: IC1.40(PC9)
ENC_LEFT_CHA: IC1.42(PA9)
ENC_LEFT_CHB: IC1.41(PA8)
ENC_RIGHT_CHA: IC1.59(PB7)
ENC_RIGHT_CHB: IC1.58(PB6)
GND: C1.2 C2.2 C3.2 C4.2 C5.2 C6.2 C7.2 C8.2 C9.2 C11.2 C12.2 C13.2 IC1.12(VSSA) IC1.18(VSS_1) IC1.63(VSS_2) J1.3 R2.1 R3.1 R7.2 R8.2 R9.2 R11.1 R12.1 S1.1
HEARTBEAT: IC1.55(PB3) LED2.A
IMU1_SCL: IC1.61(PB8)
IMU1_SDA: IC1.62(PB9)
IRD1: IC1.14(PA0_WKUP)
IRD2: IC1.15(PA1)
IRD3: IC1.8(PC0)
IRD4: IC1.9(PC1)
LED_PINK: IC1.56(PB4) LED1.A
LED_YELLOW_SUBMARINE: IC1.57(PB5) LED3.A
N$1: R4.2 RGB1.P$2(R)
N$2: LED1.C R7.1
N$3: R5.2 RGB1.P$4(G)
N$4: R6.2 RGB1.P$3(B)
N$5: LED2.C R8.1
N$6: LED3.C R9.1
N$7: R11.2 S2.2
N$8: C8.1 IC1.31(VCAP_1)
N$9: R12.2 S4.1
N$10: C9.1 IC1.47(VCAP_2)
NRST: C11.1 IC1.7(NRST) S1.2
PTR1: IC1.16(PA2)
PTR2: IC1.17(PA3)
PTR3: IC1.10(PC2)
PTR4: IC1.11(PC3)
RGB_B: IC1.27(PB1) R6.1
RGB_G: IC1.26(PB0) R5.1
RGB_R: IC1.23(PA7) R4.1
SWCLK: IC1.49(PA14) J1.2
SWDIO: IC1.46(PA13) J1.1 R10.1
UART3_RX: IC1.52(PC11)
UART3_TX: IC1.51(PC10)
V_BAT: C10.2 IC1.1(VBAT)
V_BAT_LEVEL: IC1.22(PA6)
Unconnected: IC1.2(PC13) IC1.3(PC14) IC1.4(PC15) IC1.5(PH0) IC1.6(PH1) IC1.20(PA4) IC1.21(PA5) IC1.24(PC4) IC1.25(PC5) IC1.29(PB10) IC1.30(PB11) IC1.35(PB14) IC1.36(PB15) IC1.43(PA10) IC1.44(PA11) IC1.45(PA12) IC1.50(PA15) IC1.53(PC12) IC1.54(PD2)

### Buses
IRS_AND_PTS_RIGHT:IRD3,IRD4,PTR3,PTR4
ENCODER_LEFT:ENC_LEFT_CHA,ENC_LEFT_CHB
MOTOR_DRIVER:DRV_A_IN1,DRV_A_IN2,DRV_B_IN1,DRV_B_IN2
MPU6050:IMU1_SCL,IMU1_SDA
UART:UART3_RX,UART3_TX
POWER:+3V3,GND,V_BAT_LEVEL
ENCODER_RIGHT:ENC_RIGHT_CHA,ENC_RIGHT_CHB
IRS_AND_PTS_LEFT:IRD1,IRD2,PTR1,PTR2

### Notes on the sheet
- Note:
  For SWDIO bidirectional management, the line must be pulled-up on the board (100 KΩ recommended by Arm ® ).
- To increase EMC performance, unused clocks, counters or I/Os, should not be left free, e.g.
  I/Os should be set to “0” or “1”(pull-up or pull-down to the unused I/O pins.) and unused
  features should be “frozen” or disabled.
  Note: To reduce leakage it is advisable to configure the I/O as an analog input or to push-pull and
  to set it to “0”.
- The V BAT pin can be connected to the external battery (1.65 V < V BAT < 3.6 V). If no
  external battery is used, it is recommended to connect this pin to V DD with a 100 nF
  external ceramic decoupling capacitor.

### Library data of the parts
C1-C13 = 0-micromouse2019:C-US: CAPACITOR, American symbol; SPICEPREFIX: C
IC1 = 0-micromouse2019:MCU_STM32F405RGT6_L: MCU 32-Bit, ARM Cortex M4, 1MB Flash STMicroelectronics STM32F405RGT6, 32bit ARM Cortex M4F Microcontroller, 168MHz, 1024 kB Flash, 64-Pin LQFP Source: Datasheet <http://www.mouser.com/datasheet/2/389/stm32f405rg-956214.pdf>; DESCRIPTION: MCU 32-Bit, ARM Cortex M4, 1MB Flash STMicroelectronics STM32F405RGT6, 32bit ARM Cortex M4F Microcontroller, 168MHz, 1024 kB Flash, 64-Pin LQFP; HEIGHT: 1.6mm; MANUFACTURER_NAME: STMicroelectronics; MANUFACTURER_PART_NUMBER: STM32F405RGT6; MOUSER_PART_NUMBER: 511-STM32F405RGT6
J1 = 0-micromouse2019:CONN_PROG: JST (JAPAN SOLDERLESS TERMINALS) - SM03B-SRSS-TB(LF)(SN) - HEADER, R/A, 3WAY Source: Datasheet <http://uk.rs-online.com/web/p/products/5151507P>; DESCRIPTION: JST (JAPAN SOLDERLESS TERMINALS) - SM03B-SRSS-TB(LF)(SN) - HEADER, R/A, 3WAY; HEIGHT: mm; MANUFACTURER_NAME: JST (JAPAN SOLDERLESS TERMINALS); MANUFACTURER_PART_NUMBER: SM03B-SRSS-TB(LFSN); RS_PART_NUMBER: 5151507P; RS_PRICE-STOCK: http://uk.rs-online.com/web/p/products/5151507P
LED1 LED2 = 0-micromouse2019:LED: Indicator LEDs; SERIES_RESISTOR: 100R
LED3 = 0-micromouse2019:LED: Indicator LEDs; SERIES_RESISTOR: 270R
R1-R12 = 0-micromouse2019:R-US_: RESISTOR, American symbol; SPICEPREFIX: R
RGB1 = 0-micromouse2019:LED_RGB: RGB LED; SERIES_RESISTOR_B: 100R; SERIES_RESISTOR_G: 100R; SERIES_RESISTOR_R: 270R
S1 S3 = 0-micromouse2019:BTN_B3U-1000P: OMRON ELECTRONIC COMPONENTS - B3U-1000P - SWITCH, SPST-NO, 0.05A, 12V, SMD Source: Datasheet <http://www.mouser.com/datasheet/2/307/en-b3u-3615.pdf>; DESCRIPTION: OMRON ELECTRONIC COMPONENTS - B3U-1000P - SWITCH, SPST-NO, 0.05A, 12V, SMD; HEIGHT: mm; MANUFACTURER_NAME: Omron Electronics; MANUFACTURER_PART_NUMBER: B3U-1000P; MOUSER_PART_NUMBER: 653-B3U-1000P
S2 S4 = 0-micromouse2019:BTN_B3U-3000P: OMRON ELECTRONIC COMPONENTS - B3U-3000P - TACTILE SWITCH, SIDE ACTUATED, SMD Source: Datasheet <http://www.mouser.com/datasheet/2/307/en-b3u-3615.pdf>

## Module IR_LEDS_AND_PTS
Ports: PTR1(out) PTR2(out) IRD1(in) IRD2(in) GND(pwr) VCC(pwr)
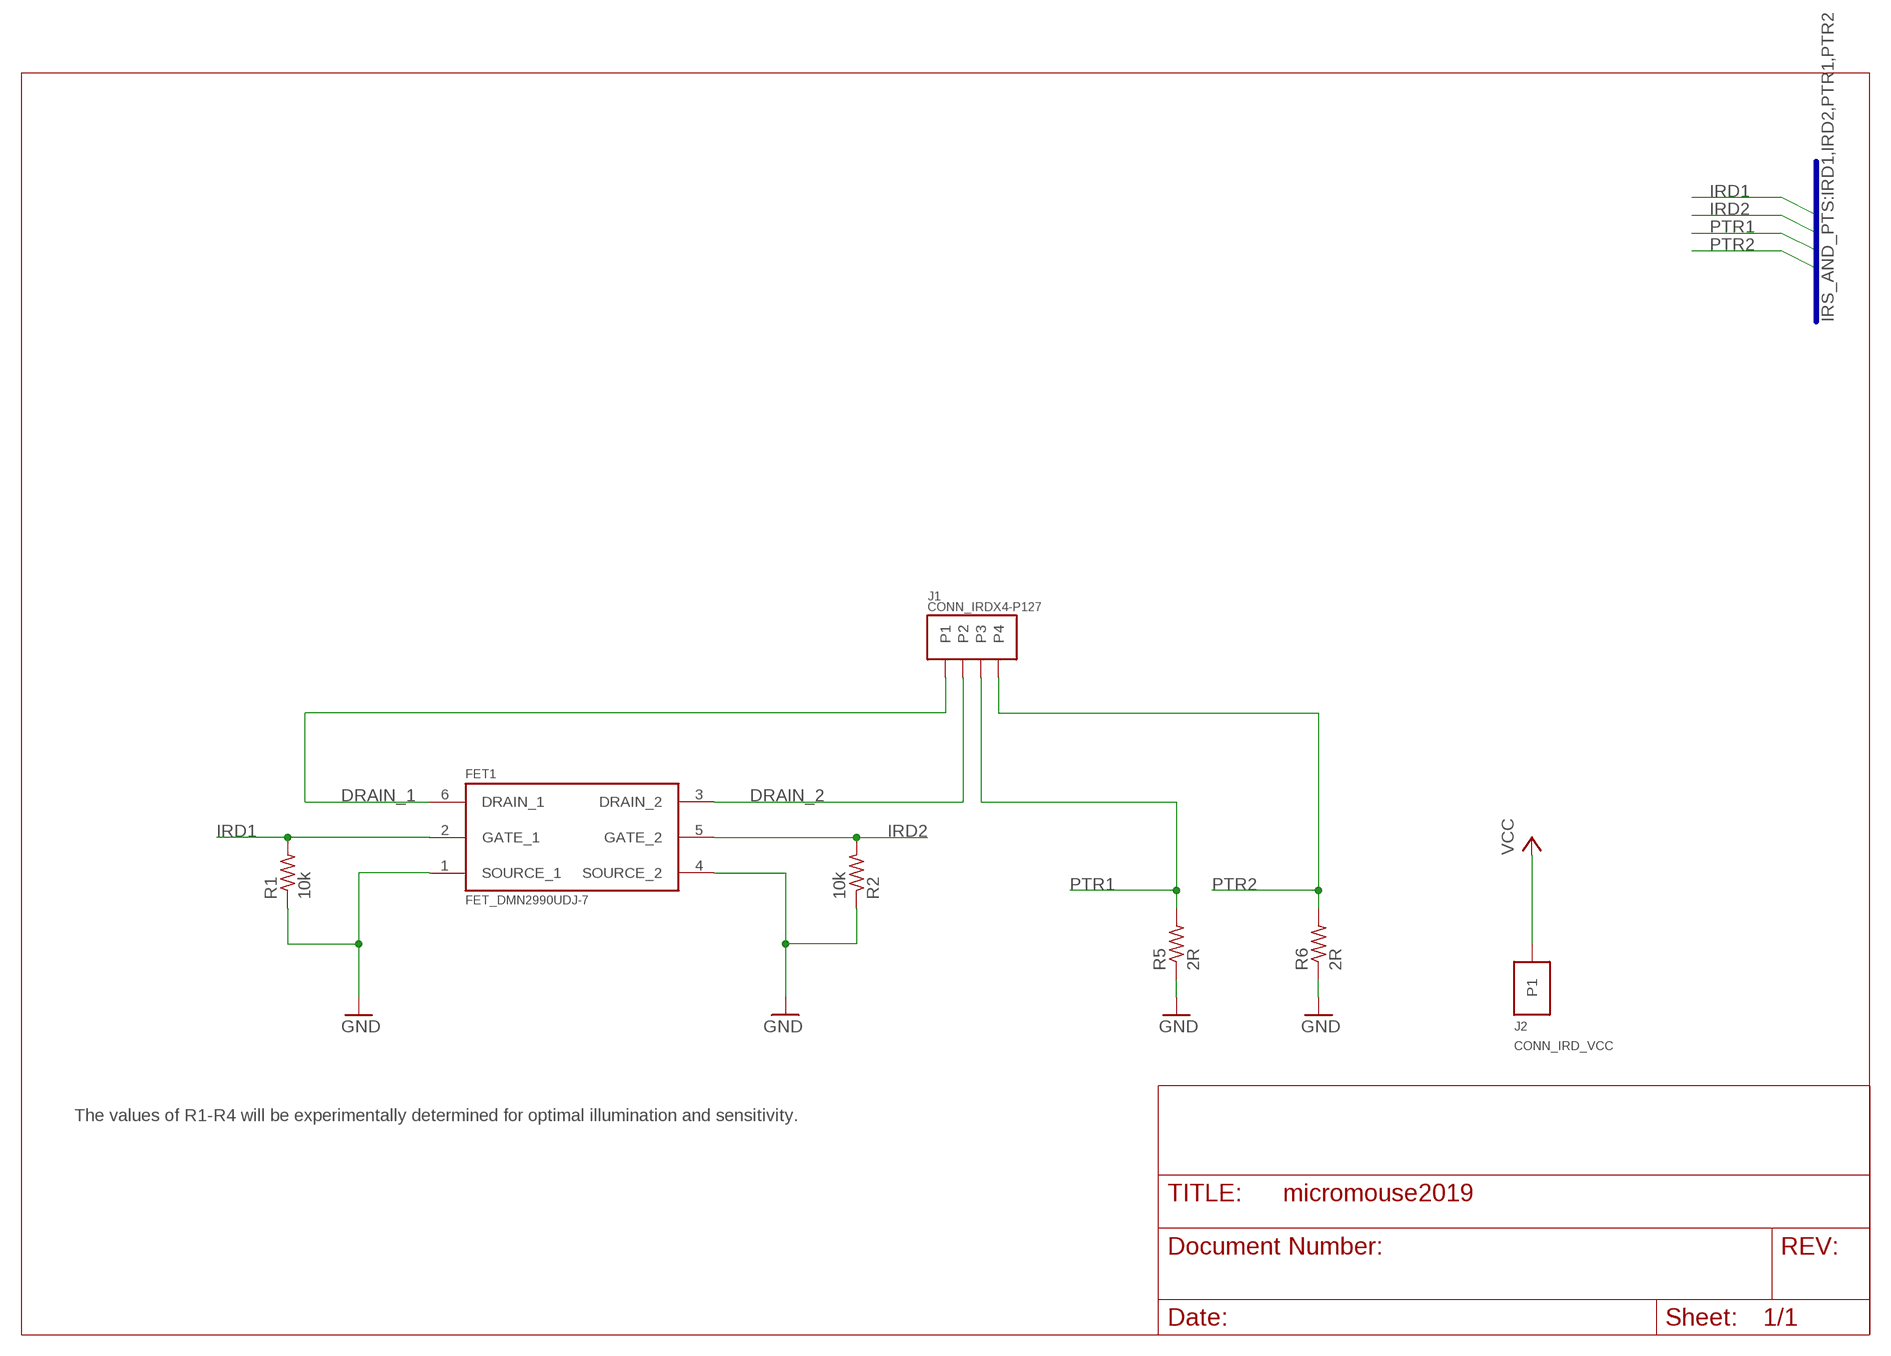
[diagram p7: schematic, module IR_LEDS_AND_PTS, sheet 1]

### Parts
FET1  FET_DMN2990UDJ-7  [SOTFL35P100X50-6]
J1  CONN_IRDX4-P127  [CONN_IRDX4_HDRV4W25P127_1X4_500X200X600B]
J2  CONN_IRD_VCC  [CONN_IRD_VCC_HDRV1W64P0_1X1_254X254X838B]
R1  10k  R-US_R0402  [R0402]
R2  10k  R-US_R0402  [R0402]
R5  2R  R-US_R0402  [R0402]
R6  2R  R-US_R0402  [R0402]

### Nets
DRAIN_1: FET1.6(DRAIN_1) J1.1
DRAIN_2: FET1.3(DRAIN_2) J1.2
GND: FET1.1(SOURCE_1) FET1.4(SOURCE_2) R1.1 R2.1 R5.1 R6.1
IRD1: FET1.2(GATE_1) R1.2
IRD2: FET1.5(GATE_2) R2.2
PTR1: J1.3 R5.2
PTR2: J1.4 R6.2
VCC: J2.1

### Buses
IRS_AND_PTS:IRD1,IRD2,PTR1,PTR2

### Notes on the sheet
- The values of R1-R4 will be experimentally determined for optimal illumination and sensitivity.

### Library data of the parts
FET1 = 0-micromouse2019:FET_DMN2990UDJ-7
J1 = 0-micromouse2019:CONN_IRDX4: Connection pins for IR LEDs
J2 = 0-micromouse2019:CONN_IRD_VCC: Pin for connection to +3v3 of IR LEDs and phototransistors
R1 R2 R5 R6 = 0-micromouse2019:R-US_: RESISTOR, American symbol; SPICEPREFIX: R

## Board
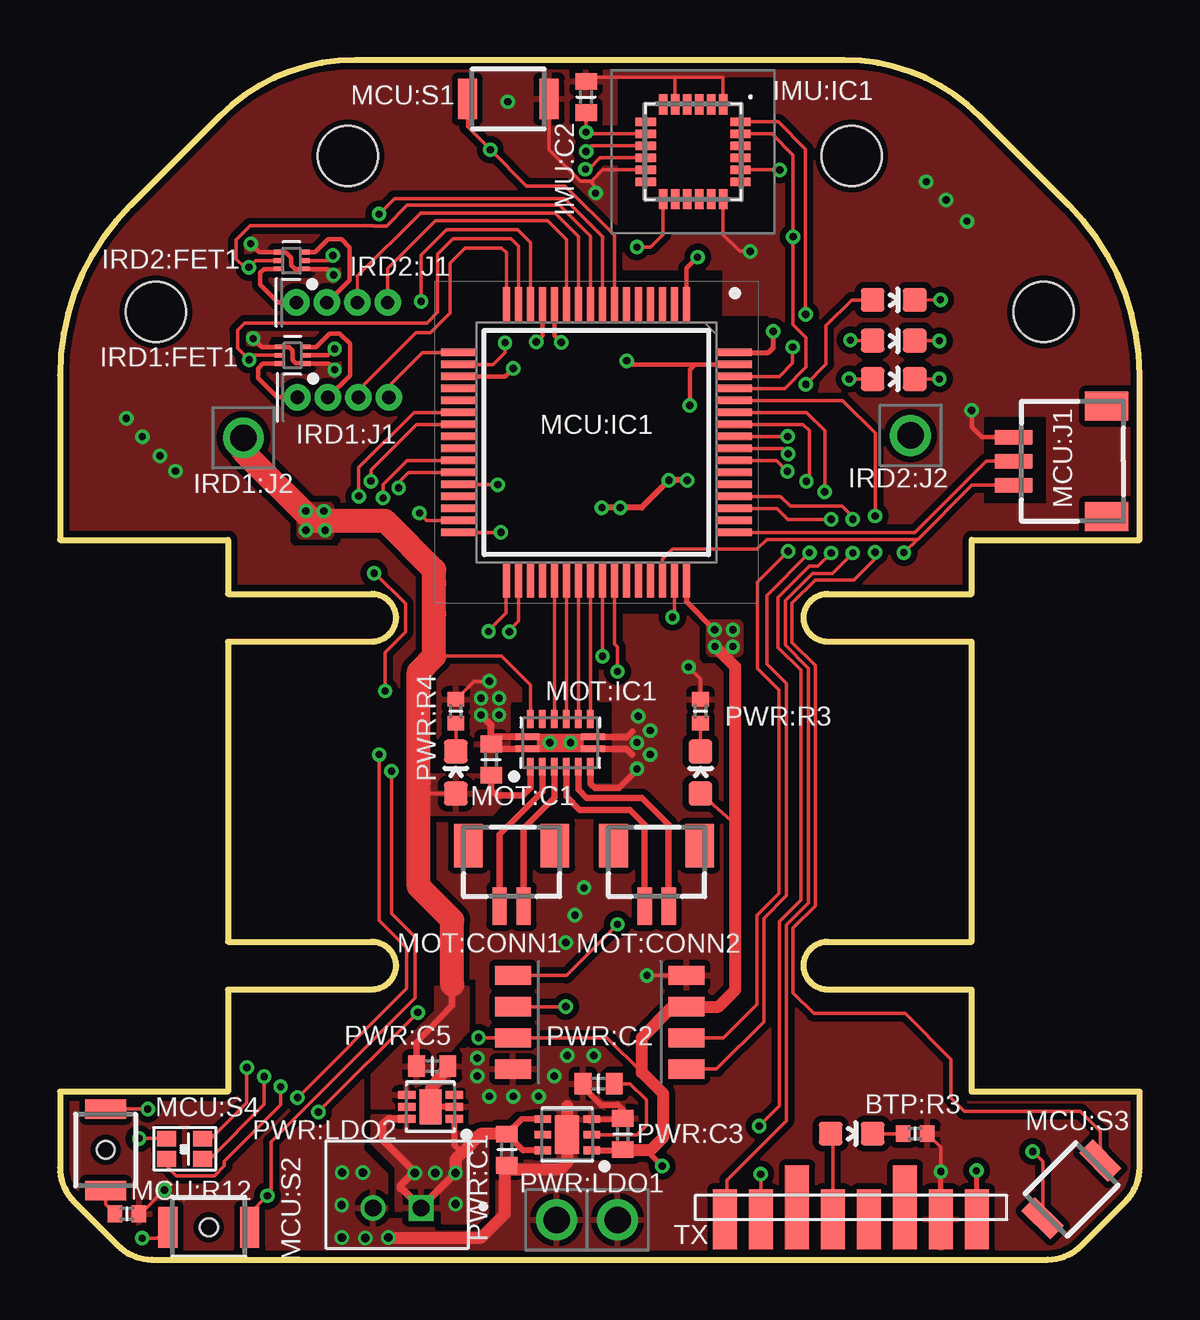
[diagram p8: board, top side]
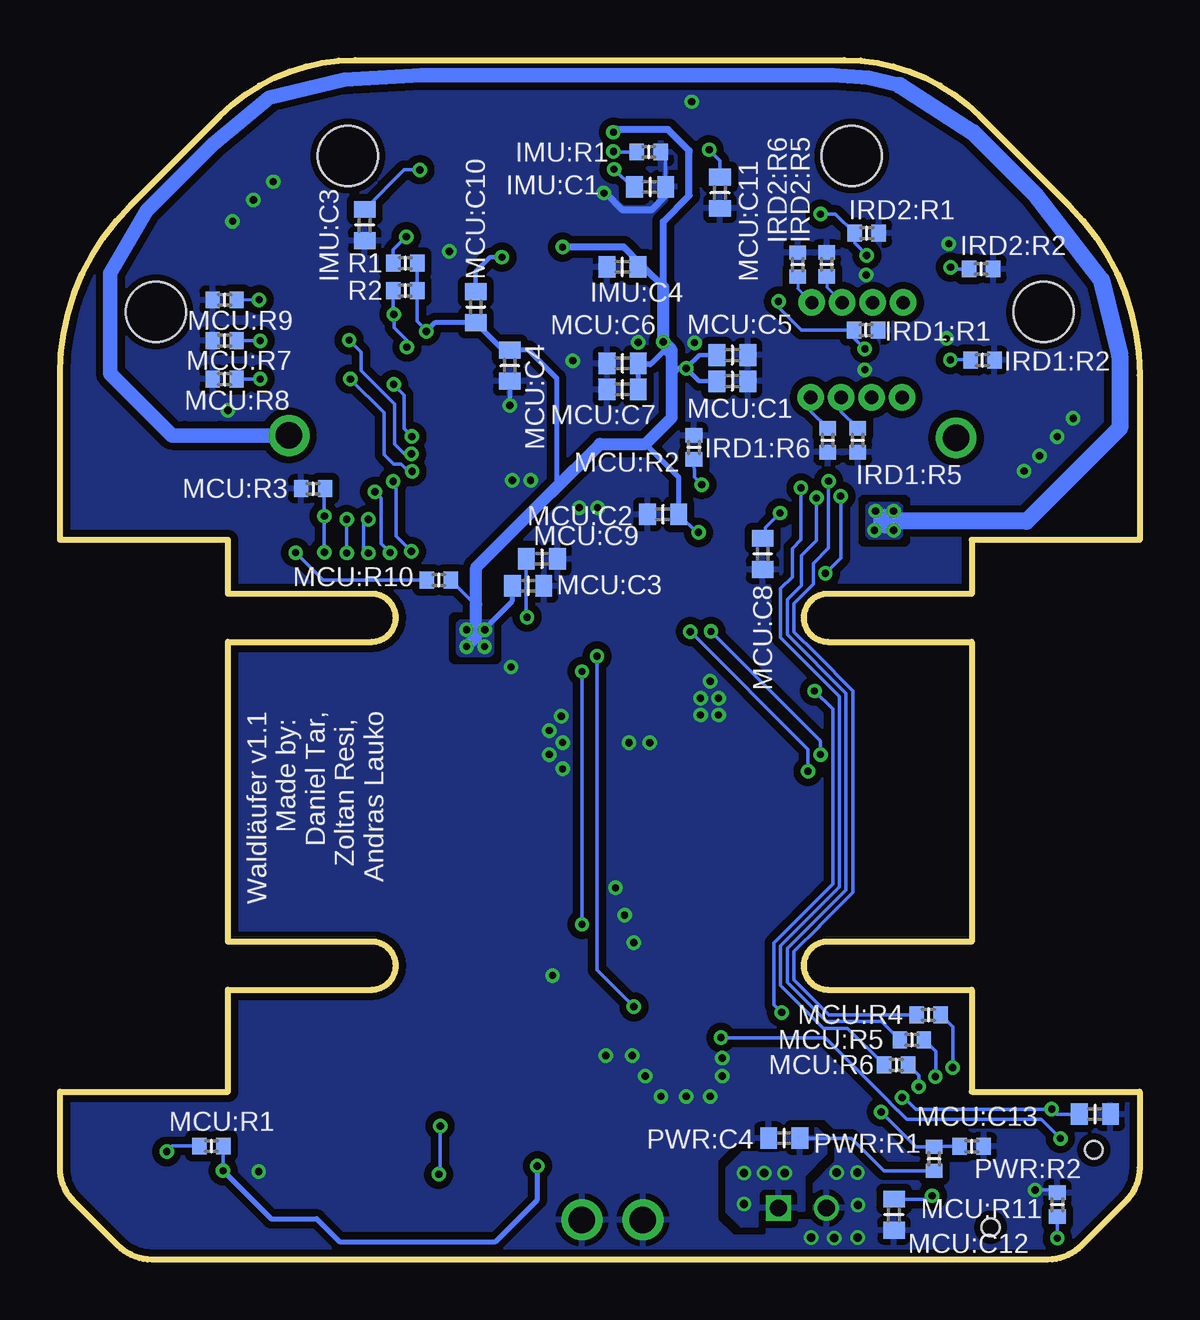
[diagram p9: board, bottom side, seen from below]

Size 45 x 50 mm. Coordinates in mm from the lower left corner, seen from the top.
Outline: 32,27.75 38,27.75 38,30 45,30 45,36.86 arc45 42.07,43.93 38.34,47.66 arc45 32.69,50 12.31,50 arc45 6.66,47.66 2.93,43.93 arc45 0,36.86 0,30 7,30 7,27.75 13,27.75 arc-180 13,25.75 7,25.75 7,13.25 13,13.25 arc-180 13,11.25 7,11.25 7,7 0,7 0,3.83 arc45 0.59,2.41 2.41,0.59 arc45 3.83,0 41.17,0 arc45 42.59,0.59 44.41,2.41 arc45 45,3.83 45,7 38,7 38,11.25 32,11.25 arc-180 32,13.25 38,13.25 38,25.75 32,25.75 arc-180 32,27.75
Copper layers (1*16): Top 0.035mm / dielectric 1.5mm / Bottom 0.035mm
Design rules "JLC_PCB_design_rules": minimum track width 5mil, minimum drill 0.2mm, track to track 5mil, track to pad 5mil, pad to pad 5mil, via to via 5mil, smd to smd 5mil, copper to edge 0.2mm, drill to drill 5mil, minimum pad ring 3mil, minimum via ring 3mil, stop-mask expansion 4mil, vias tented up to drill 0mil, thermal gap 10mil
Holes 2.5 mm at 12,46 41,39.5 33,46 4,39.5
tKeepout: area 6.9,11.3 to 13.6,27.8; area 31.5,11.2 to 38.1,27.7

### Footprints (pad centres in the part's own frame; a part is rotated, then mirrored left to right if it is on the bottom)
0603-BLUE = smd 1 x 1: A 0,-0.877; C 0,0.877
BT_PORT_BASE = smd 1 x 2.5: P$8 1.25,-0.5; P$9 2.75,-0.5; P$11 5.75,-0.5; P$12 7.25,-0.5; P$14 10.25,-0.5; P$15 11.75,-0.5 | smd 1 x 3.5: P$10 4.25,0; P$13 8.75,0
R0402 = smd 0.6 x 0.7: 1 -0.5,0; 2 0.5,0
CONN_IRD_VCC_HDRV1W64P0_1X1_254X254X838B = drill 1.105 pad 1.705: 1 0,0
ENC_PORT_BASE = smd 1.5 x 0.8: P1 -0.05,1.95; P2 -0.05,0.65; P3 -0.05,-0.65; P4 -0.05,-1.95
C0402 = smd 0.7 x 0.9: 1 -0.65,0; 2 0.65,0
MPU6050 = smd 0.85 x 0.35: 1 -1.975,1.25; 2 -1.975,0.75; 3 -1.975,0.25; 4 -1.975,-0.25; 5 -1.975,-0.75; 6 -1.975,-1.25; 13 1.975,-1.25; 14 1.975,-0.75; 15 1.975,-0.25; 16 1.975,0.25; 17 1.975,0.75; 18 1.975,1.25 | smd 0.35 x 0.85: 7 -1.25,-1.975; 8 -0.75,-1.975; 9 -0.25,-1.975; 10 0.25,-1.975; 11 0.75,-1.975; 12 1.25,-1.975; 19 1.25,1.975; 20 0.75,1.975; 21 0.25,1.975; 22 -0.25,1.975; 23 -0.75,1.975; 24 -1.25,1.975
SOTFL35P100X50-6 = smd 0.41 x 0.2: 1 -0.545,0.35; 2 -0.545,0; 3 -0.545,-0.35; 4 0.545,-0.35; 5 0.545,0; 6 0.545,0.35
CONN_IRDX4_HDRV4W25P127_1X4_500X200X600B = drill 0.554 pad 1.1: 1 0,0; 2 1.27,0; 3 2.54,0; 4 3.81,0
QFP50P1200X1200X160-64N = smd 1.45 x 0.3: 1 -5.75,3.75; 2 -5.75,3.25; 3 -5.75,2.75; 4 -5.75,2.25; 5 -5.75,1.75; 6 -5.75,1.25; 7 -5.75,0.75; 8 -5.75,0.25; 9 -5.75,-0.25; 10 -5.75,-0.75; 11 -5.75,-1.25; 12 -5.75,-1.75; 13 -5.75,-2.25; 14 -5.75,-2.75; 15 -5.75,-3.25; 16 -5.75,-3.75; 33 5.75,-3.75; 34 5.75,-3.25; 35 5.75,-2.75; 36 5.75,-2.25; 37 5.75,-1.75; 38 5.75,-1.25; 39 5.75,-0.75; 40 5.75,-0.25; 41 5.75,0.25; 42 5.75,0.75; 43 5.75,1.25; 44 5.75,1.75; 45 5.75,2.25; 46 5.75,2.75; 47 5.75,3.25; 48 5.75,3.75 | smd 0.3 x 1.45: 17 -3.75,-5.75; 18 -3.25,-5.75; 19 -2.75,-5.75; 20 -2.25,-5.75; 21 -1.75,-5.75; 22 -1.25,-5.75; 23 -0.75,-5.75; 24 -0.25,-5.75; 25 0.25,-5.75; 26 0.75,-5.75; 27 1.25,-5.75; 28 1.75,-5.75; 29 2.25,-5.75; 30 2.75,-5.75; 31 3.25,-5.75; 32 3.75,-5.75; 49 3.75,5.75; 50 3.25,5.75; 51 2.75,5.75; 52 2.25,5.75; 53 1.75,5.75; 54 1.25,5.75; 55 0.75,5.75; 56 0.25,5.75; 57 -0.25,5.75; 58 -0.75,5.75; 59 -1.25,5.75; 60 -1.75,5.75; 61 -2.25,5.75; 62 -2.75,5.75; 63 -3.25,5.75; 64 -3.75,5.75
SM03B-SRSS-TB(LFSN) = smd 0.6 x 1.55: 1 -1,0; 2 0,0; 3 1,0 | smd 1.2 x 1.8: 4 -2.3,-3.875; 5 2.3,-3.875
0603-PINK = smd 1 x 1: A 0,-0.877; C 0,0.877
0603-GREEN = smd 1 x 1: A 0,-0.877; C 0,0.877
0603-YELLOW = smd 1 x 1: A 0,-0.877; C 0,0.877
D_RGB_0603 = smd 0.8 x 0.65: P$1 0,0; P$2 1.5,0; P$3 0,-0.85; P$4 1.5,-0.85
B3U-1000P = smd 0.8 x 1.7: 1 1.7,0; 2 -1.7,0
B3U-3000P = smd 0.8 x 1.7: 1 1.7,0; 2 -1.7,0 | hole 0.75: 0,0
BM02B-SRSS-TB(LFSN) = smd 0.6 x 1.55: 1 -0.5,0; 2 0.5,0 | smd 1.2 x 1.8: 3 -1.8,2.525; 4 1.8,2.525
DRV8836 = smd 0.738 x 0.27: 1 -0.996,1.25; 2 -0.996,0.75; 3 -0.996,0.25; 4 -0.996,-0.25; 5 -0.996,-0.75; 6 -0.996,-1.25; 7 0.996,-1.25; 8 0.996,-0.75; 9 0.996,-0.25; 10 0.996,0.25; 11 0.996,0.75; 12 0.996,1.25 | smd 0.27 x 1: 14 0.25,1.369; 15 -0.25,1.369; 16 -0.25,-1.369; 17 0.25,-1.369
JST_B2B-PH-K-S(LF)(SN) = drill 0.7 square: 1 1,-0.55 | drill 0.7: 2 -1,-0.55
SON65P200X200X80-7T100X160 = smd 0.688 x 0.32: 1 -1.021,0.65; 2 -1.021,0; 3 -1.021,-0.65; 4 1.021,-0.65; 5 1.021,0; 6 1.021,0.65 | smd 1 x 1.6: 7 0,0
SON50P200X200X80-7T92X145 = smd 0.737 x 0.32: 1 -0.987,0.5; 2 -0.987,0; 3 -0.987,-0.5; 4 0.987,-0.5; 5 0.987,0; 6 0.987,0.5 | smd 0.92 x 1.45: 7 0,0
0603-ORANGE = smd 1 x 1: A 0,-0.877; C 0,0.877
0603-RED = smd 1 x 1: A 0,-0.877; C 0,0.877

### Placement (x,y rotation side)
BTP:LED3  LED_B  [0603-BLUE]  33,5.25 270 top
BTP:PORT1  PORT_BT_BASE  [BT_PORT_BASE]  26.47,2.17 0 top
BTP:R3  100R  [R0402]  35.65,5.25 180 top
CONN1  23.24,1.65 0 top
CONN2  20.7,1.65 0 top
EPL:PORT1  PORT_ENC_BASE  [ENC_PORT_BASE]  18.94,9.89 0 top
EPR:PORT1  PORT_ENC_BASE  [ENC_PORT_BASE]  26.06,9.89 180 top
IMU:C1  100n  [C0402]  20.4,44.71 0 bottom
IMU:C2  100n  [C0402]  21.93,48.46 90 top
IMU:C3  2.2n  [C0402]  32.3,43.12 270 bottom
IMU:C4  10n  [C0402]  21.55,41.37 180 bottom
IMU:IC1  IMU_MPU-6050  [MPU6050]  26.39,46.17 270 top
IMU:R1  47k  [R0402]  20.45,46.17 180 bottom
IRD1:FET1  FET_DMN2990UDJ-7  [SOTFL35P100X50-6]  9.7,37.69 180 top
IRD1:J1  CONN_IRDX4-P127  [CONN_IRDX4_HDRV4W25P127_1X4_500X200X600B]  9.9,35.94 0 top
IRD1:J2  CONN_IRD_VCC  [CONN_IRD_VCC_HDRV1W64P0_1X1_254X254X838B]  7.64,34.25 0 top
IRD1:R1  10k  [R0402]  11.4,38.74 180 bottom
IRD1:R2  10k  [R0402]  6.55,37.49 180 bottom
IRD1:R5  2R  [R0402]  11.75,34.15 90 bottom
IRD1:R6  2R  [R0402]  13,34.15 90 bottom
IRD2:FET1  FET_DMN2990UDJ-7  [SOTFL35P100X50-6]  9.65,41.64 180 top
IRD2:J1  CONN_IRDX4-P127  [CONN_IRDX4_HDRV4W25P127_1X4_500X200X600B]  9.85,39.89 0 top
IRD2:J2  CONN_IRD_VCC  [CONN_IRD_VCC_HDRV1W64P0_1X1_254X254X838B]  35.45,34.35 0 top
IRD2:R1  10k  [R0402]  11.37,42.78 180 bottom
IRD2:R2  10k  [R0402]  6.6,41.29 180 bottom
IRD2:R5  2R  [R0402]  13.04,41.48 270 bottom
IRD2:R6  2R  [R0402]  14.25,41.47 270 bottom
MCU:C1  100n  [C0402]  16.97,36.61 0 bottom
MCU:C2  100n  [C0402]  19.86,31.06 180 bottom
MCU:C3  100n  [C0402]  25.48,28.08 0 bottom
MCU:C4  100n  [C0402]  26.25,37.26 270 bottom
MCU:C5  4.7u  [C0402]  16.97,37.7 0 bottom
MCU:C6  100n  [C0402]  21.55,37.35 180 bottom
MCU:C7  1u  [C0402]  21.55,36.27 180 bottom
MCU:C8  2.2u  [C0402]  15.71,29.42 270 bottom
MCU:C9  2.2u  [C0402]  24.92,29.21 0 bottom
MCU:C10  100n  [C0402]  27.67,39.7 90 bottom
MCU:C11  100n  [C0402]  17.49,44.47 270 bottom
MCU:C12  100n  [C0402]  10.23,1.87 270 bottom
MCU:C13  100n  [C0402]  1.86,6.06 0 bottom
MCU:IC1  MCU_STM32F405RGT6_L  [QFP50P1200X1200X160-64N]  22.36,34.06 270 top
MCU:J1  CONN_SWD  [SM03B-SRSS-TB(LFSN)]  39.75,33.27 90 top
MCU:LED1  LED_P  [0603-PINK]  34.75,38.3 270 top
MCU:LED2  LED_G  [0603-GREEN]  34.75,36.7 270 top
MCU:LED3  LED_Y  [0603-YELLOW]  34.75,40 270 top
MCU:R1  1k  [R0402]  38.69,4.73 0 bottom
MCU:R2  10k  [R0402]  18.57,33.85 270 bottom
MCU:R3  10k  [R0402]  34.45,32.13 0 bottom
MCU:R4  270R  [R0402]  8.8,10.2 0 bottom
MCU:R5  100R  [R0402]  9.49,9.16 0 bottom
MCU:R6  100R  [R0402]  10.14,8.11 0 bottom
MCU:R7  100R  [R0402]  38.13,38.3 180 bottom
MCU:R8  100R  [R0402]  38.13,36.7 180 bottom
MCU:R9  270R  [R0402]  38.13,40 180 bottom
MCU:R10  100k  [R0402]  29.21,28.32 0 bottom
MCU:R11  1k  [R0402]  3.43,2.29 270 bottom
MCU:R12  1k  [R0402]  2.79,1.91 180 top
MCU:RGB1  LED_RGB-0603  [D_RGB_0603]  4.45,5.05 0 top
MCU:S1  BTN_B3U-1000P  [B3U-1000P]  18.68,48.38 0 top
MCU:S2  BTN1  [B3U-3000P]  6.2,1.34 0 top
MCU:S3  BTN_B3U-1000P  [B3U-1000P]  42.16,2.92 45 top
MCU:S4  BTN2  [B3U-3000P]  1.91,4.57 270 top
MOT:C1  4u7  [C0402]  17.97,20.84 90 top
MOT:CONN1  MOTOR1  [BM02B-SRSS-TB(LFSN)]  18.82,14.73 0 top
MOT:CONN2  MOTOR2  [BM02B-SRSS-TB(LFSN)]  24.87,14.73 0 top
MOT:IC1  MOT_DRV88361  [DRV8836]  20.86,21.54 90 top
PWR:C1  1u  [C0402]  18.63,4.58 270 top
PWR:C2  10n  [C0402]  22.45,7.33 180 top
PWR:C3  2u2  [C0402]  23.46,5.23 90 top
PWR:C4  1u  [C0402]  14.81,5.06 180 bottom
PWR:C5  10u  [C0402]  15.52,8.06 0 top
PWR:CONN1  CONN_BATTERY  [JST_B2B-PH-K-S(LF)(SN)]  14.05,2.7 0 top
PWR:LDO1  PS_TPS735DRVT  [SON65P200X200X80-7T100X160]  21.14,5.2 180 top
PWR:LDO2  PS_LDL112PU  [SON50P200X200X80-7T92X145]  15.45,6.37 180 top
PWR:LED1  LED_O  [0603-ORANGE]  26.7,20.3 0 top
PWR:LED2  LED_R  [0603-RED]  16.5,20.3 0 top
PWR:R1  47k  [R0402]  8.56,4.2 270 bottom
PWR:R2  47k  [R0402]  6.99,4.72 180 bottom
PWR:R3  270R  [R0402]  26.7,22.85 270 top
PWR:R4  270R  [R0402]  16.5,22.85 270 top
R1  30.61,41.53 0 bottom
R2  30.61,40.39 0 bottom

### Tracks (layer width: path | path; a pad name or v marks a point on that pad's centre or on a via)
+3V3  (via drill 0.3 pad 0.6)
  Top 0.152: 24.25,7.8 22.81,9.24 EPL:PORT1.P3 v17.46,9.24 v17.45,9.25 | MCU:RGB1.P$1 v3.3,5.05 | 28.15,18.3 27.98,18.3 PWR:LED1.A | IMU:C2.1 v21.93,46.99 22,46.92 22.67,46.92 IMU:IC1.8 | IMU:IC1.13 25.14,42.73 24.61,42.2 v24.05,42.2 | MCU:IC1.32 v18.38,30.31
  Top 0.178: MCU:IC1.13 20.11,38.51 v19.85,38.25 | v18.9,37.15 18.56,36.81 MCU:IC1.19
  Top 0.203: BTP:PORT1.P$15 38.22,3.68 v38.2,3.7 | v25.1,3.9 24.63,4.37 24.63,4.58 | MCU:IC1.48 26.11,27.43 v27.29,26.25 | MCU:IC1.64 29.53,37.81 29.73,38.01 v29.73,38.69
  Top 0.254: PWR:LDO1.1 23.42,4.54 PWR:C3.1
  Top 0.5: PWR:C3.1 24.63,4.58 25.15,5.1 25.15,6.9 24.25,7.8 24.25,9.25 25.55,10.55 25.56,10.54 EPR:PORT1.P3 27.44,10.54 28.15,11.25 28.15,18.3 28.15,24.7 v27.3,25.55
  Bottom 0.127: 18.77,46.18 18.77,46.23
  Bottom 0.152: v17.45,9.25 13.1,9.25 10.4,6.55 10.4,6.54 10.11,6.25 10.1,6.25 9.7,5.85 4.1,5.85 v3.3,5.05 | MCU:R1.2 v38.19,3.71 v38.2,3.7 | MCU:R10.2 27.69,27.3 27.65,27.3 | R1.2 R2.2 30.11,39.12 29.73,38.74 v29.73,38.69 | v18.38,30.31 18.46,30.31 MCU:C2.1
  Bottom 0.178: 20.35,37.35 MCU:C6.1 20.9,37.3 | 19.85,37.85 v19.85,38.25 | MCU:C1.1 18.36,36.61 v18.9,37.15 18.35,37.7 MCU:C5.1
  Bottom 0.203: v38.2,3.7 36.2,1.7 34.3,1.7 33.35,0.75 26.85,0.75 25.1,2.5 v25.1,3.9 | 20.6,34 19.21,32.61 MCU:C2.1 | v18.9,37.15 19.2,37.15 19.5,36.85 | 19.8,37.85 19.85,37.85 20.35,37.35 20.4,37.3 20.9,37.3 | 19.8,37.85 19.5,37.55 | v19.85,38.25 19.8,38.2 19.8,37.85 | MCU:C6.1 MCU:C7.1 | 24.55,31.95 24.3,32.2 24.3,36.75 25.46,37.91 MCU:C4.1 26.53,37.91 MCU:C10.1 29.37,39.05 v29.73,38.69 | MCU:C3.1 26.16,28.05 26.16,27.43 27.29,26.31 v27.29,26.25
  Bottom 0.3: 18.77,46.23 19.65,47.1 21.82,47.1 v21.93,46.99 | 19.85,40.55 19.85,43.27 18.77,44.34 18.77,46.18 | 19.85,40.55 19.85,40.51 | 19.85,40.55 20.67,41.37 IMU:C4.1 20.9,41.6 21.5,42.2 v24.05,42.2
  Bottom 0.5: v28.05,25.55 27.65,25.95 27.65,27.3 27.65,28.85 24.55,31.95 22.5,34 20.6,34 19.5,35.1 19.5,36.85 19.5,37.55 19.5,37.9 v19.85,38.25 19.85,40.51
  other vias: 28.05,26.25
  pour Bottom: 28.3,26.6 28.4,26.5 28.4,25.3 28.3,25.2 27.1,25.2 27,25.3 27,26.5 27.1,26.6
  pour Top: 27.1,26.6 28.3,26.6 28.4,26.5 28.4,25.3 28.3,25.2 27.1,25.2 27,25.3 27,26.3 27,26.5
BTP:BT_STATUS
  Top 0.152: BTP:PORT1.P$11 32.22,5.15 BTP:LED3.A
BTP:N$3
  Top 0.152: BTP:LED3.C BTP:R3.2
DRV_A_IN1
  Top 0.152: MCU:IC1.37 MOT:IC1.10
DRV_A_IN2
  Top 0.152: MCU:IC1.38 MOT:IC1.9
DRV_B_IN1
  Top 0.152: MCU:IC1.39 MOT:IC1.8
DRV_B_IN2
  Top 0.152: MCU:IC1.40 MOT:IC1.7
ENC_LEFT_CHA  (via drill 0.3 pad 0.6)
  Top 0.152: MCU:IC1.42 23.11,25.66 23.24,25.53 v23.24,24.51 | v23.24,13.97 21.11,11.84 EPL:PORT1.P1
  Bottom 0.152: v23.24,24.51 v23.24,13.97
ENC_LEFT_CHB  (via drill 0.3 pad 0.6)
  Top 0.152: MCU:IC1.41 v22.61,25.15 | v21.08,10.54 EPL:PORT1.P2
  Bottom 0.152: v22.61,25.15 22.61,12.07 v21.08,10.54
ENC_RIGHT_CHA  (via drill 0.3 pad 0.6)
  Top 0.152: MCU:IC1.59 31.11,35.31 31.88,34.54 v31.88,32 | v31.24,29.46 29.46,27.69 29.46,24.82 30.28,24 30.28,15.17 29.34,14.22 29.34,9.91 27.37,7.94 EPR:PORT1.P1
  Bottom 0.152: v31.88,32 31.62,31.75 31.62,29.84 v31.24,29.46
ENC_RIGHT_CHB  (via drill 0.3 pad 0.6)
  Top 0.152: MCU:IC1.58 30.98,34.81 31.24,34.54 31.24,32.56 v31.12,32.44 | v30.35,29.52 29.08,28.25 29.08,24.64 29.97,23.75 29.97,15.25 29.06,14.34 29.06,10.64 27.66,9.24 EPR:PORT1.P2
  Bottom 0.152: v31.12,32.44 30.99,32.31 30.99,30.15 v30.35,29.52
GND  (via drill 0.3 pad 0.6, 0.35 pad 0.6)
  Top 0.127: IRD2:FET1.4 9.21,41.98
  Top 0.152: EPR:PORT1.P4 v24.47,11.84 | BTP:R3.1 36.72,4.68 v36.72,3.67 | PWR:R3.1 26.7,24.2 v26.2,24.7 | IMU:C2.2 22.1,49.28 25.7,49.28 | 25.7,49.28 27.64,49.28 IMU:IC1.1 | PWR:R4.1 17.25,24.1 v17.9,24.1 | 25.7,49.28 25.64,49.22 IMU:IC1.5 | MCU:IC1.18 18.06,37.31 18.55,37.8 v18.55,38.22 | IMU:IC1.18 27.64,42.72 28.34,42.02 v28.77,42.02 | IMU:IC1.11 22.89,45.42 | 22.89,45.42 | 22.89,45.42 22.62,45.42 22.2,45 22.2,44.85 | v22.33,44.45 22.33,44.72 22.2,44.85 | 22.2,44.85 22.1,44.95 21.69,44.95 20.39,46.25 MCU:S1.1 | v4.35,2.9 3.36,1.91 MCU:R12.1
  Top 0.178: MCU:IC1.12 20.61,38.52 v20.9,38.23 | MCU:IC1.63 26.46,37.31 | 26.46,37.31 26.25,37.1 v26.25,35.6 | MCU:J1.3 38.42,34.27 38,34.69 v38,35.4 | v11.4,41.04 11.15,41.29 IRD2:FET1.1 9.8,41.29 9.64,41.45 9.64,41.76 9.43,41.98 9.21,41.98 | IRD2:FET1.4 8.3,41.99 v7.95,42.34 | v11.45,37.09 11.2,37.34 IRD1:FET1.1 10.21,37.37 9.82,37.37 9.7,37.5 9.7,37.89 9.54,38.04 IRD1:FET1.4 8.4,38.04 v8.05,38.39 | 26.46,37.31 23.78,37.31 v23.62,37.47
  Top 0.203: BTP:PORT1.P$14 v36.72,3.67
  Top 0.254: PWR:LDO1.3 23.44,5.86 PWR:C3.2 23.46,6.24 23.25,6.45 22.55,6.45 21.8,7.2 PWR:C2.2 | PWR:LDO2.2 PWR:LDO2.7 | v26.14,32.48 v25.38,32.48 24.24,31.34 v23.35,31.34 v22.59,31.34
  Top 0.27: MOT:C1.2 18.17,21.29 MOT:IC1.15 20,21.29 | MOT:IC1.6 22.11,19.84 22.3,19.65 23.3,19.65 24.05,20.4 v24.05,20.45 | MOT:IC1.17 23.63,21.79 23.86,22.02 | 23.85,21.05 23.61,21.29 MOT:IC1.16 21.7,21.29 | 20.17,21.29 21.53,21.29 | MOT:IC1.14 21.54,21.79 | 21.7,21.29 21.53,21.29 | 21.53,21.29 v21.29,21.54 | v21.29,21.54 v21.28,21.54 | MOT:IC1.17 21.54,21.79 | 21.54,21.79 v21.29,21.54 | 20.17,21.29 20,21.29 | 21.54,21.79 21.54,21.3 21.53,21.29 | 20.17,21.75 20.17,21.79 v20.42,21.54 | 20.17,21.75 20.17,21.29 | 20.17,21.75 20,21.75 20,21.29 | MOT:IC1.17 21.7,21.79 21.7,21.29
  Top 0.3: MOT:C1.2 17.97,21.8 | 17.97,21.8 17.97,22.28 v17.55,22.7 | MOT:IC1.14 17.98,21.79 17.97,21.8
  Top 0.5: 21.14,6.4 PWR:LDO1.7 21.14,4.04 20.85,3.75 18.81,3.75 PWR:C1.2 18.55,3.85 18.55,1.9 17.56,0.91 v13.68,0.91 | PWR:LDO2.7 15.46,7.12 PWR:C5.2
  Top 0.7: v20.42,21.54 v20.43,21.54 v21.29,21.54
  Bottom 0.152: IMU:R1.1 19.75,45.97 IMU:C1.2 19.75,44.35 | 22.25,44.45 v22.33,44.45 | MCU:R11.1 3.56,2.91 4.34,2.91 v4.35,2.9
  Bottom 0.178: v26.25,35.6 MCU:C4.2
  Bottom 0.3: 19.75,44.35 20.35,43.75 21.55,43.75 22.25,44.45
  other vias: 12.73,0.89 11.75,0.92 11.74,2.27 11.76,3.63 12.63,3.62 17.4,8.4 17.4,7.65 17.9,6.8 18.9,6.8 19.95,6.8 20.6,7.65 21.15,8.5 22.25,8.5 24.05,21.55 24.6,21.05 24.6,22.05 24.1,22.65 18.3,22.7 18.3,23.4 17.55,23.4 4.16,33.5 4.81,32.86 36.11,44.93 36.94,44.17 37.81,43.28 2.77,35.06 3.43,34.3 21.08,13.21 21.46,14.35 21.84,15.49 18.67,48.26
  pour Bottom (isolate 0.305, rank 3): 0,0 45,0 45,45.75 45,50 6.75,50 0,50
  pour Top: 16.45,8.5 16.7,8.75 22.65,8.75 22.75,8.65 22.75,8.1 22.45,7.8 22.45,7.05 21.8,6.4 19.5,6.4 19.35,6.25 16.45,6.25
  pour Top: 17.5,24.35 18.1,24.35 18.75,23.7 18.75,22.25 17.2,22.25 17.2,22.7 16.75,23.15 16.75,23.6
  pour Top: 23.75,23.15 23.55,22.95 23.55,20.45 23.55,20.2 23.75,20 23.8,19.95 24.7,19.95 24.9,19.95 25.1,20.15 25.1,22.95 24.9,23.15
  cutout Top: 15.25,38.75 15.25,29.35 27.05,29.35 27.05,38.75
  cutout Top: 17.65,38.75 27.56,38.75 27.56,41.15 17.65,41.15
  cutout Top: 29.5,29.35 29.5,39.26 27.05,39.26 27.05,29.35
  cutout Top: 27.05,29.35 17.65,29.35 17.65,27 27.05,27
  cutout Top: 23.3,49.2 23.3,42.9 29.7,42.9 29.7,49.2
  cutout Top: 8.85,42.29 8.85,40.99 10.45,40.99 10.45,42.29
  cutout Top: 8.85,38.39 8.85,36.99 10.55,36.99 10.55,38.39
  cutout Top: 18.85,23.15 18.85,19.9 22.95,19.9 22.95,23.15
  cutout Top: 38.57,35.05 38.57,31.59 41.06,31.59 41.06,35.05
  pour Top (isolate 0.254, rank 2): 0,0 45,0 45,50 0,50
IMU:AD0  (via drill 0.3 pad 0.6)
  Top 0.152: v21.93,46.19 22.16,46.42 IMU:IC1.9
  Bottom 0.152: v21.93,46.19 21.91,46.17 IMU:R1.2
IMU:CPOUT  (via drill 0.3 pad 0.6)
  Top 0.152: v30,45.42 | IMU:IC1.20 v30,45.42
  Bottom 0.152: v30,45.42 30.65,45.42 IMU:C3.1
IMU:REGOUT  (via drill 0.3 pad 0.6)
  Top 0.152: IMU:IC1.10 22.91,45.92 22.52,45.92 22.05,45.45 v21.9,45.45
  Bottom 0.152: v21.9,45.45 21.16,44.71 IMU:C1.1
IRD1:DRAIN_1
  Top 0.178: IRD1:FET1.6 8.45,37.34 8.25,37.14 8.25,36.74 9.05,35.94 IRD1:J1.1
IRD1:DRAIN_2
  Top 0.178: IRD1:FET1.3 10.67,38.04 11.24,38.6 11.66,38.6 12.09,38.17 12.09,36.85 IRD1:J1.2
IRD2:DRAIN_1
  Top 0.178: IRD2:FET1.6 8.5,41.29 8.35,41.14 8.35,40.64 9.1,39.89 IRD2:J1.1
IRD2:DRAIN_2
  Top 0.127: IRD2:J1.2 11.14,39.89
  Top 0.178: IRD2:FET1.3 10.64,41.99 11.19,42.53 11.73,42.53 12.08,42.19 12.08,40.82 11.14,39.89
MCU:BOOT0  (via drill 0.3 pad 0.6)
  Top 0.152: MCU:IC1.60 32.62,35.81 33.98,34.45 v33.98,30.99 | MCU:S3.1 43.37,5.34 42.54,6.17 37.7,6.17 37.14,6.73 37.14,8.35 35.23,10.26 31.42,10.26 30.56,11.12 30.56,13.83 31.48,14.75 31.48,24.76 30.52,25.72 30.52,27.36 31.48,28.32 33.09,28.32 33.98,29.21 v33.98,29.48
  Bottom 0.152: v33.98,29.48 v33.98,30.99 33.98,32.1 MCU:R3.2
MCU:BOOT1  (via drill 0.3 pad 0.6)
  Top 0.152: v18.25,32.3 MCU:IC1.28
  Bottom 0.152: MCU:R2.2 18.56,32.61 v18.25,32.3
MCU:BTN1  (via drill 0.3 pad 0.6)
  Top 0.152: v13.82,20.35 13.82,14.43 14.8,13.45 14.8,10.91 8.8,4.91 8.8,2.81 v8.64,2.66 7.9,1.92 MCU:S2.1 | v18.73,26.17 18.73,26.23 19.11,26.61 MCU:IC1.34
  Bottom 0.152: v13.82,20.35 13.82,21.26 v18.73,26.17 | MCU:C12.1 8.78,2.52 v8.64,2.66
MCU:BTN2  (via drill 0.3 pad 0.6)
  Top 0.152: MCU:S4.2 v3.66,6.27 | v9.9,6.75 14.45,11.3 14.45,12.99 13.3,14.14 v13.3,21.05 | v17.87,26.18 17.87,26.22 18.6,26.95 MCU:IC1.33
  Bottom 0.152: v9.9,6.75 9.8,6.75 9.32,6.27 v3.66,6.27 3.45,6.06 MCU:C13.1 | v13.3,21.05 13.3,21.61 v17.87,26.18
MCU:BTN_BOOT0  (via drill 0.3 pad 0.6)
  Top 0.152: v40.55,4.5 40.96,4.09 MCU:S3.2
  Bottom 0.152: MCU:R1.1 40.32,4.73 v40.55,4.5
MCU:HEARTBEAT  (via drill 0.3 pad 0.6)
  Top 0.152: MCU:IC1.55 29.87,33.31 v30.32,32.85 | MCU:LED2.A v32.9,36.7
  Bottom 0.152: v30.32,32.85 30.35,32.88 30.51,32.88 30.78,33.15 31.1,33.15 31.5,33.55 31.5,35.3 v32.9,36.7
MCU:LED_PINK  (via drill 0.3 pad 0.6)
  Top 0.152: MCU:IC1.56 30.12,33.81 30.12,33.8 30.13,33.8 v30.35,33.58 | MCU:LED1.A 32.97,38.3 v32.95,38.32
  Bottom 0.152: v30.35,33.58 30.63,33.58 31.05,34 31.05,35.65 32.45,37.05 32.45,37.83 v32.95,38.32
MCU:LED_YELLOW_SUBMARINE  (via drill 0.3 pad 0.6)
  Top 0.152: MCU:IC1.57 v30.33,34.31 | MCU:LED3.A 33,40 31.94,38.94 31.94,37.32 v31.09,36.48
  Bottom 0.152: v30.33,34.31 30.65,34.62 30.65,36.04 v31.09,36.48
MCU:N$1  (via drill 0.3 pad 0.6)
  Top 0.152: MCU:RGB1.P$2 6.3,5.05 7.79,6.54 v7.79,8
  Bottom 0.152: MCU:R4.2 7.79,9.69 v7.79,8
MCU:N$2  (via drill 0.3 pad 0.6)
  Top 0.152: MCU:LED1.C v36.66,38.3
  Bottom 0.152: v36.66,38.3 MCU:R7.1
MCU:N$3  (via drill 0.3 pad 0.6)
  Top 0.152: v8.51,7.62 8.51,6.46 6.25,4.2 MCU:RGB1.P$4
  Bottom 0.152: MCU:R5.2 8.5,8.67 v8.5,7.63 v8.51,7.62
MCU:N$4  (via drill 0.3 pad 0.6)
  Top 0.152: v9.2,7.2 9.2,6.45 6.85,4.1 6.85,3.9 6.45,3.5 4.85,3.5 4.45,3.9 MCU:RGB1.P$3
  Bottom 0.152: MCU:R6.2 9.2,7.67 v9.2,7.2
MCU:N$5  (via drill 0.3 pad 0.6)
  Top 0.152: MCU:LED2.C v36.66,36.7
  Bottom 0.152: v36.66,36.7 MCU:R8.1
MCU:N$6  (via drill 0.3 pad 0.6)
  Top 0.152: v36.7,40.01 MCU:LED3.C
  Bottom 0.152: v36.7,40.01 MCU:R9.1
MCU:N$7  (via drill 0.3 pad 0.6)
  Top 0.152: MCU:S2.2 4.05,0.89 v3.43,0.89
  Bottom 0.152: v3.43,0.89 MCU:R11.2
MCU:N$8  (via drill 0.3 pad 0.6)
  Top 0.152: MCU:IC1.31 15.29,30.81 v14.99,31.11
  Bottom 0.152: v14.99,31.11 15.58,30.52 15.58,30.19 MCU:C8.1
MCU:N$9
  Top 0.152: MCU:S4.1 1.91,2.29 MCU:R12.2
MCU:N$10  (via drill 0.3 pad 0.6)
  Top 0.152: MCU:IC1.47 25.61,26.85 v25.53,26.77
  Bottom 0.152: MCU:C9.1 25.57,26.81 v25.53,26.77
MCU:NRST  (via drill 0.3 pad 0.6)
  Top 0.152: MCU:S1.2 16.98,47.22 v17.94,46.26 19.45,44.75 19.8,44.75 21.05,44.75 23.11,42.69 23.11,41.3 MCU:IC1.7
  Bottom 0.152: MCU:C11.1 17.49,45.81 v17.94,46.26
MCU:RGB_B  (via drill 0.3 pad 0.6)
  Top 0.152: MCU:IC1.27 14.54,32.8 14.11,32.38 v14.11,32.16
  Bottom 0.152: MCU:R6.1 12.17,9.64 13.17,9.64 14.96,11.43 14.96,13.08 12.51,15.53 12.51,23.48 14.96,25.93 14.96,27.96 14.48,28.45 14.48,29.64 14.11,30.01 v14.11,32.16
MCU:RGB_G  (via drill 0.3 pad 0.6)
  Top 0.152: MCU:IC1.26 14.47,33.31 13.46,32.3 v13.46,31.74
  Bottom 0.152: MCU:R5.1 10.75,9.92 13.06,9.92 14.68,11.54 14.68,12.96 12.23,15.42 12.23,23.59 14.68,26.05 14.68,27.5 14.09,28.1 14.09,29.34 13.46,29.96 v13.46,31.74
MCU:RGB_R  (via drill 0.3 pad 0.6)
  Top 0.152: MCU:IC1.23 14.86,34.81 12.96,32.91 v12.96,32.44
  Bottom 0.152: MCU:R4.1 12.94,10.2 14.4,11.66 14.4,12.84 13.35,13.89 13.35,13.9 11.95,15.3 11.95,23.71 13.5,25.25 14.4,26.16 14.4,27.34 13.6,28.15 13.6,29.01 12.96,29.65 v12.96,32.44
MCU:SWCLK
  Top 0.152: MCU:J1.2 38.61,33.27 35.64,30.3 MCU:IC1.49
MCU:SWDIO  (via drill 0.3 pad 0.6)
  Top 0.152: MCU:J1.1 38.01,32.27 35.76,30.02 | 35.76,30.02 32.35,30.02 29.46,30.02 29.05,29.61 25.53,29.61 25.11,29.19 MCU:IC1.46 | v35.18,29.46 35.74,30.02 35.76,30.02
  Bottom 0.152: MCU:R10.1 34.04,28.32 v35.18,29.46
MCU:V_BAT  (via drill 0.3 pad 0.6)
  Top 0.178: MCU:IC1.1 26.11,41.31 v26.58,41.78
  Bottom 0.178: v26.58,41.78 27.07,41.78 27.67,41.18 MCU:C10.2
MOT:AOUT1
  Top 0.27: MOT:IC1.2 20.11,19.51 18.32,17.72 MOT:CONN1.1
MOT:AOUT2
  Top 0.27: MOT:IC1.3 20.61,19.26 19.32,17.97 MOT:CONN1.2
MOT:BOUT1
  Top 0.27: MOT:IC1.4 21.11,19.29 21.65,18.75 23.75,18.75 24.37,18.13 MOT:CONN2.1
MOT:BOUT2
  Top 0.27: MOT:IC1.5 21.61,19.59 21.95,19.25 24.25,19.25 25.37,18.13 MOT:CONN2.2
N$1  (via drill 0.3 pad 0.6)
  Top 0.152: MCU:IC1.14 19.61,42.39 19.08,42.92 16.11,42.92 15.05,41.86 v15.05,39.94 | 11.18,37.69 v11.45,37.96
  Top 0.178: IRD1:FET1.2 11.18,37.69
  Bottom 0.152: v15.05,39.94 15.05,39.69 14.1,38.74 IRD1:R1.2 11.9,38.41 v11.45,37.96
N$2  (via drill 0.3 pad 0.6)
  Top 0.152: IRD1:FET1.5 8.07,37.69 v7.88,37.5 7.4,37.99 7.4,38.74 7.7,39.04 15.3,39.04 15.75,39.49 15.75,41.91 16.38,42.55 18.8,42.55 19.11,42.23 MCU:IC1.15
  Bottom 0.152: v7.88,37.5 7.07,37.5 IRD1:R2.2
N$3
  Top 0.152: IRD1:J1.3 12.44,36.24 14.84,38.64 15.45,38.64 16.26,39.44 16.26,41.53 16.89,42.16 18.41,42.16 18.61,41.97 MCU:IC1.16
  Bottom 0.152: IRD1:J1.3 12.45,35.93 12.45,35.35 IRD1:R5.2
N$4
  Top 0.152: MCU:IC1.17 15.12,37.81 13.7,36.39 IRD1:J1.4
  Bottom 0.152: IRD1:J1.4 13.71,35.36 IRD1:R6.2
N$5  (via drill 0.3 pad 0.6)
  Top 0.152: MCU:IC1.8 22.61,42.64 21.02,44.23 13.95,44.23 v13.3,43.58 | v11.37,41.86 11.15,41.64 IRD2:FET1.2
  Bottom 0.152: v13.3,43.58 12.67,43.58 IRD2:R1.2 11.87,42.35 v11.37,41.86
N$6  (via drill 0.3 pad 0.6)
  Top 0.152: IRD2:FET1.5 8.16,41.64 v7.88,41.36 7.7,41.36 7.35,41.71 7.35,42.51 7.93,43.08 13.08,43.08 13.09,43.08 13.61,43.08 14.48,43.94 20.83,43.94 22.11,42.66 MCU:IC1.9
  Bottom 0.127: 7.81,41.29 v7.88,41.36
  Bottom 0.152: IRD2:R2.2 7.81,41.29
N$7
  Top 0.127: 12.39,40.99 IRD2:J1.3
  Top 0.152: MCU:IC1.10 21.61,42.64 20.63,43.62 15.02,43.62 12.39,40.99
  Bottom 0.127: IRD2:R5.2 13.04,40.54 IRD2:J1.3
N$8
  Top 0.152: MCU:IC1.11 21.11,42.52 20.32,43.31 15.66,43.31 13.66,41.31 IRD2:J1.4
  Bottom 0.127: IRD2:R6.2 14.25,40.48 IRD2:J1.4
PWR:N$1
  Top 0.127: 22.19,5.2 PWR:LDO1.2
  Top 0.152: PWR:C2.1 23.77,7.33 24.45,6.65 24.45,5.6 24.05,5.2 22.19,5.2
PWR:N$2
  Top 0.152: PWR:LED1.C PWR:R3.2
PWR:N$4
  Top 0.152: PWR:R4.2 PWR:LED2.C
PWR:V_BAT_IN  (via drill 0.35 pad 0.6)
  Top 0.254: PWR:LDO1.4 19.26,5.86 PWR:C1.1 19.31,4.54 PWR:LDO1.6 | PWR:LDO2.1 16.43,4.77 16.75,4.45
  Top 0.305: v16.49,3.61 15.05,2.17 PWR:CONN1.1 14.25,2.95 14.2,2.95 14.2,3.1 14.75,3.65 | v14.79,3.61 14.79,3.66 13.45,5 13.45,5.65 13.67,5.87 PWR:LDO2.6
  Top 0.5: PWR:C1.1 17.53,5.23 16.75,4.45 16.49,4.19 v16.49,3.61
  Bottom 0.152: PWR:C4.1 12.01,5.06 10.65,3.7 PWR:R1.2
  other vias: 16.49,2.31 15.64,3.61
  pour Top: 14,2.05 15.95,2.05 15.95,1.53 17.4,1.53 17.82,1.95 17.82,5.3 14.75,5.3 14.7,5.35 14.7,6 13,6 13,4.85 14,3.85
  pour Bottom: 14,2.05 15.95,2.05 15.95,1.4 16.6,1.4 17.2,2 17.2,3.8 16.55,4.45 14.75,4.45 14.75,5.45 13.45,5.45 13.1,5.1 13.1,4.4 14,3.5
SCL  (via drill 0.3 pad 0.6)
  Top 0.127: 30.55,41.14 30.56,41.15 30.55,41.14
  Top 0.152: MCU:IC1.61 30.21,36.31 31.1,37.2 31.1,37.47 31.1,38.43 30.56,38.97 30.56,41.15 v30.56,42.63 | v30.56,42.63 30.56,43.05 30.56,46.04 29.68,46.92 IMU:IC1.23 | v30.56,42.63
  Bottom 0.152: v30.56,42.63 31.11,42.09 R1.1
SDA  (via drill 0.3 pad 0.6)
  Top 0.152: MCU:IC1.62 29.98,36.81 30.54,37.37 v30.54,38.03 | v31.08,39.4 31.08,46.28 29.94,47.42 IMU:IC1.24
  Bottom 0.152: v30.54,38.03 30.54,38.3 31.08,38.84 v31.08,39.4 31.11,39.43 R2.1
UART3_RX  (via drill 0.3 pad 0.6)
  Top 0.152: MCU:IC1.52 30.04,31.81 30.45,31.4 32.6,31.4 33.05,30.95 v33.05,30.85 | v33.05,29.45 32.2,28.6 31.36,28.6 30.24,27.48 30.24,25.6 31.2,24.64 31.2,14.87 30.28,13.95 30.28,5.78 27.8,3.3 27.8,1.75 BTP:PORT1.P$8
  Bottom 0.152: v33.05,30.85 v33.05,29.45
UART3_TX  (via drill 0.3 pad 0.6)
  Top 0.152: MCU:IC1.51 29.89,31.31 30.35,30.85 v32.15,30.85 | v32.15,29.45 31.6,28.9 31.25,28.9 29.93,27.58 29.93,25.52 30.88,24.57 30.88,14.98 29.98,14.08 29.98,6.4 v29.15,5.57 | v29.21,3.56 29.22,3.55 BTP:PORT1.P$9
  Bottom 0.152: v32.15,30.85 32.35,30.65 32.35,29.65 v32.15,29.45 | v29.15,5.57 29.15,3.62 v29.21,3.56
V_BAT_LEVEL  (via drill 0.3 pad 0.6)
  Top 0.152: v10.77,6.15 v14.92,10.3 | v13.55,23.7 13.55,25.1 13.55,25.31 14.4,26.16 14.4,27.34 13.14,28.6 v13.09,28.6 | MCU:IC1.22 14.76,35.31 12.46,33.01 v12.46,31.82
  Bottom 0.152: PWR:R2.2 8.54,4.72 PWR:R1.1 9.33,4.7 v10.77,6.14 v10.77,6.15 | v14.92,10.3 15.24,10.62 15.24,13.19 12.79,15.65 12.79,22.94 v13.55,23.7 | v12.46,31.82 12.46,29.23 v13.09,28.6
VCC  (via drill 0.3 pad 0.6)
  Top 0.152: PWR:LED2.A 14.96,19.42 14.95,19.43 | MOT:IC1.12 19.61,23.95 18.41,25.15 15.6,25.15 | v11.05,30.4 10.65,30.8
  Top 0.27: MOT:IC1.1 19.61,19.66 19.3,19.35 18.2,19.35 17.97,19.58 MOT:C1.1 | PWR:C5.1 14.87,9.05 16.35,10.6 16.35,11.45
  Top 1: 16.35,11.45 16.35,14.15 14.95,15.55 14.95,19.43 14.95,19.9 14.95,24.5 15.6,25.15 15.6,26.92 15.6,28.19 15.6,28.75 13.55,30.8 10.65,30.8 | 10.52,30.8 7.64,33.68 IRD1:J2.1
  Bottom 0.6: IRD2:J2.1 38.31,34.35 39.8,34.35 40.33,34.35 42.9,36.92 42.9,41.12 41.39,43.73 38.62,46.5 36.28,48.42 33.16,49.17 29.95,49.37 12.78,49.37 11.31,49.26 10,48.94
  Bottom 0.7: 10,48.94 6.93,46.97 4.34,44.38 1.58,40.83 0.83,37.67 0.83,34.65 4.7,30.78 10.58,30.78
  Bottom 1: 10.58,30.78 10.6,30.8
  other vias: 10.25,31.2 11,31.2 10.25,30.4
  pour Top: 15.65,11.35 15.65,10.35 13,7.7 13,6.33 14.13,6.33 17,9.56 17,11.35
  pour Top: 18.35,20.2 18.35,18.9 18,18.55 15.25,18.55 15.25,20.2
  pour Bottom (isolate 0.254): 11.25,31.5 11.35,31.4 11.35,30.2 11.25,30.1 10.05,30.1 9.95,30.2 9.95,31.4 10.05,31.5
  pour Top (isolate 0.254): 10.05,31.5 11.25,31.5 11.35,31.4 11.35,30.2 11.25,30.1 10.05,30.1 9.95,30.2 9.95,31.4

### Text on the board
bNames: Waldläufer v1.1 / Made by: / Daniel Tar, / Zoltan Resi, / Andras Lauko
Notes: For Single&Double Layer PCB, the minimum trace width is 5 mil; | For Single&Double Layer PCB, the minimum spacing is 5 mil; | For Single&Double Layer PCB, the minimum via hole size is 0.3mm; | For Single&Double Layer PCB, the minimum Via diameter is 0.6mm; | Minimum distance between via(plated holes) and trace is 5mil. | Min. drill size is 0.2mm, Max. drill size is 6.3mm; | Hole Size Tolerance: ±0.08mm / e.g. For the 0.6mm hole, the finished hole size between 0.52mm to 0.68mm is acceptable. | Annular ring surrounded by traces should be equal to or larger than 3mil; | Characters width less than 6mil(0.153mm) will be unidentifiable. | Characters height less than 32mil will be unidentifiable. | Ship as individual board(Rounting): / Trace to Outline ≥0.2mm; | Ship as panel with V-scoring: / Trace to V-cut line ≥0.4mm | Half hole is a special technology, so half hole diameter should be greater than 0.6mm.